# EAGLE design v2.1 Main (EAGLE 8.1.0)

## Sheet 1 of 3
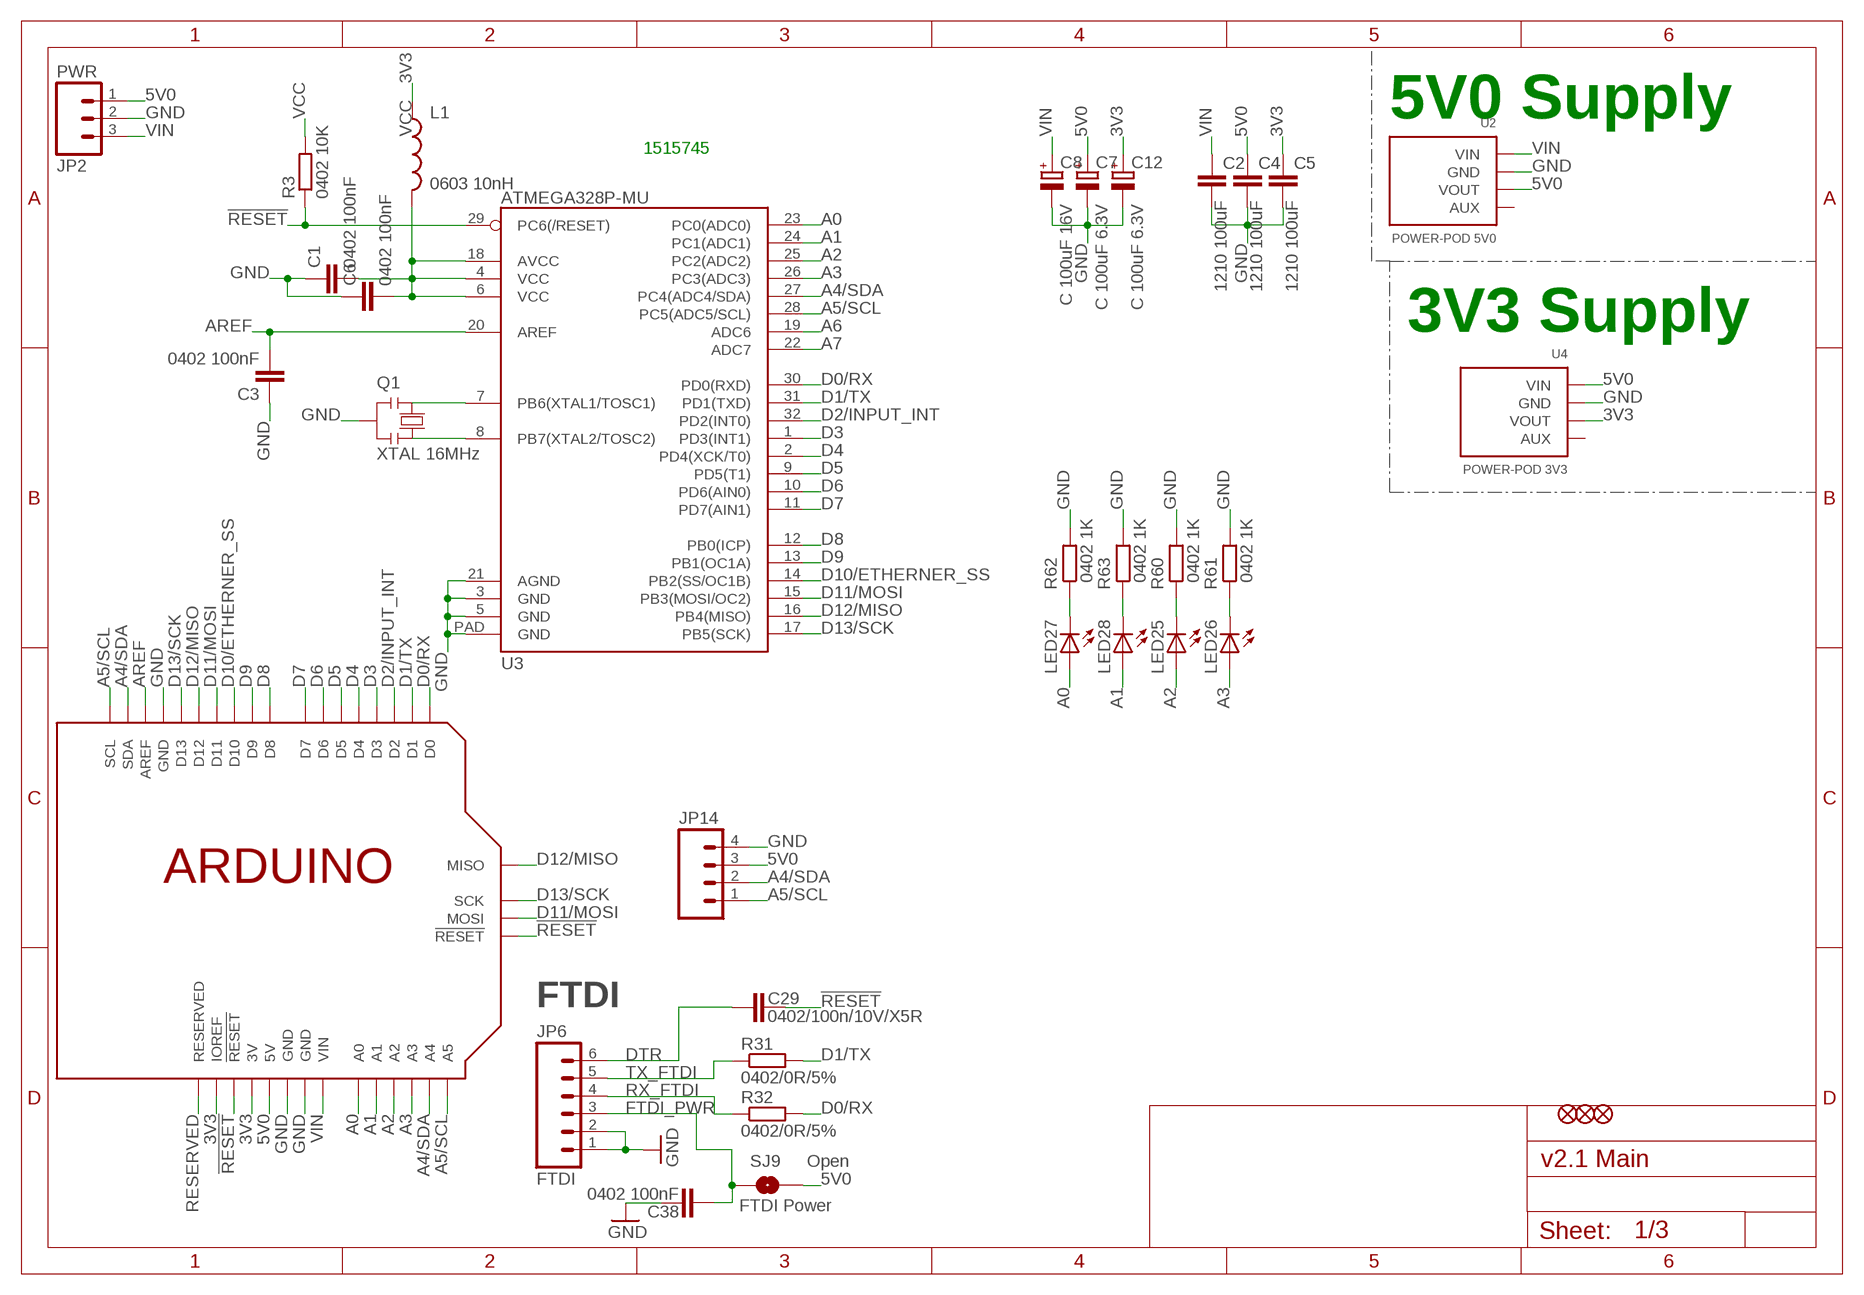
[diagram p0: schematic, sheet 1]

### Parts
C1  0402 100nF  C-EUC0402-SMALLER  [C0402-SMALLER]
C2  1210 100uF  C-EUC1210  [C1210]
C3  0402 100nF  C-EUC0402-SMALLER  [C0402-SMALLER]
C4  1210 100uF  C-EUC1210  [C1210]
C5  1210 100uF  C-EUC1210  [C1210]
C6  0402 100nF  C-EUC0402-SMALLER  [C0402-SMALLER]
C7  C 100uF 6.3V  CPOL-EUC  [PANASONIC_C]
C8  C 100uF 16V  CPOL-EUC  [PANASONIC_C]
C12  C 100uF 6.3V  CPOL-EUC  [PANASONIC_C]
C29  0402/100n/10V/X5R  C-EUC0402-ARDUINO-ROUND  [C0402-ARDUINO-ROUND]
C38  0402 100nF  C-EUC0402-SMALLER  [C0402-SMALLER]
JP2  PWR  M03-SCREW-5MM  [SCREWTERMINAL-5MM-3]
JP4  FIDUCIAL1X2.5-STOP  [FIDUCIAL-1X2.5-STOP]
JP6  FTDI  M06SIP  [1X06]
JP7  FIDUCIAL1X2.5-STOP  [FIDUCIAL-1X2.5-STOP]
JP9  FIDUCIAL1X2.5-STOP  [FIDUCIAL-1X2.5-STOP]
JP14  M04PTH  [1X04]
L1  0603 10nH  INDUCTOR0603K-SMALL  [C0603K-SMALL]
LED25  LED0805-1206  [LED-0805-1206]
LED26  LED0805-1206  [LED-0805-1206]
LED27  LED0805-1206  [LED-0805-1206]
LED28  LED0805-1206  [LED-0805-1206]
Q1  XTAL 16MHz  RESONATORMU  [RESONATOR]
R3  0402 10K  R-EU_R0402-SMALLER  [R0402-SMALLER]
R31  0402/0R/5%  R-EU_R0402-ARDUINO-ROUND  [R0402-ARDUINO-ROUND]
R32  0402/0R/5%  R-EU_R0402-ARDUINO-ROUND  [R0402-ARDUINO-ROUND]
R60  0402 1K  R-EU_R0402-SMALLER  [R0402-SMALLER]
R61  0402 1K  R-EU_R0402-SMALLER  [R0402-SMALLER]
R62  0402 1K  R-EU_R0402-SMALLER  [R0402-SMALLER]
R63  0402 1K  R-EU_R0402-SMALLER  [R0402-SMALLER]
SJ9  FTDI Power  SOLDERJUMPERTRACE  [SJ_2S-TRACE]
U1  ARDUINOSPI-REFRENCE  [ARDUINOR3-LWKTXT-REF-SPI]
U2  POWER-POD 5V0  POWER-POD  [POWER-POD-LANDING]
U3  ATMEGA328P-MU  ATMEGA328-MLF-SHORT  [MLF32-SHORT-CREAM]
U4  POWER-POD 3V3  POWER-POD  [POWER-POD-LANDING]

### Nets
3V3: C5.1 C12.+ L1.1 U1.3V U1.IOREF U4.3(VOUT)
5V0: C4.1 C7.+ JP2.1 JP14.3 SJ9.2 U1.5V U1.5V@ISP(5V) U2.3(VOUT) U4.1(VIN) ; also sheet 2,3
!RESET: C29.1 R3.1 U1.!RESET U1.!RESET@ISP(!RESET) U3.29(PC6(/RESET))
A0: LED27.A U1.A0 U3.23(PC0(ADC0))
A1: LED28.A U1.A1 U3.24(PC1(ADC1))
A2: LED25.A U1.A2 U3.25(PC2(ADC2))
A3: LED26.A U1.A3 U3.26(PC3(ADC3))
A4/SDA: JP14.2 U1.A4 U1.SDA U3.27(PC4(ADC4/SDA)) ; also sheet 2
A5/SCL: JP14.1 U1.A5 U1.SCL U3.28(PC5(ADC5/SCL)) ; also sheet 2
A6: U3.19(ADC6)
A7: U3.22(ADC7)
AREF: C3.2 U1.AREF U3.20(AREF)
D0/RX: R32.2 U1.D0 U3.30(PD0(RXD))
D1/TX: R31.2 U1.D1 U3.31(PD1(TXD))
D2/INPUT_INT: U1.D2 U3.32(PD2(INT0)) ; also sheet 2
D3: U1.D3 U3.1(PD3(INT1))
D4: U1.D4 U3.2(PD4(XCK/T0))
D5: U1.D5 U3.9(PD5(T1))
D6: U1.D6 U3.10(PD6(AIN0))
D7: U1.D7 U3.11(PD7(AIN1))
D8: U1.D8 U3.12(PB0(ICP))
D9: U1.D9 U3.13(PB1(OC1A))
D10/ETHERNER_SS: U1.D10 U3.14(PB2(SS/OC1B))
D11/MOSI: U1.D11 U1.MOSI U3.15(PB3(MOSI/OC2))
D12/MISO: U1.D12 U1.MISO U3.16(PB4(MISO))
D13/SCK: U1.D13 U1.SCK U3.17(PB5(SCK))
DTR: C29.2 JP6.6
FTDI_PWR: C38.2 JP6.3 SJ9.1
GND: C1.1 C2.2 C3.1 C4.2 C5.2 C6.1 C7.- C8.- C12.- C38.1 JP2.2 JP6.1 JP6.2 JP14.4 Q1.2 R60.2 R61.2 R62.2 R63.2 U1.GND@1(GND) U1.GND@2(GND) U1.GND@3(GND) U1.GND@ISP(GND) U2.2(GND) U3.3(GND) U3.5(GND) U3.21(AGND) U3.PAD(GND) U4.2(GND) ; also sheet 2
N$3: Q1.1 U3.7(PB6(XTAL1/TOSC1))
N$4: Q1.3 U3.8(PB7(XTAL2/TOSC2))
N$5: LED27.C R62.1
N$28: LED28.C R63.1
N$29: LED25.C R60.1
N$30: LED26.C R61.1
RESERVED: U1.RESERVED
RX_FTDI: JP6.4 R32.1
TX_FTDI: JP6.5 R31.1
VCC: C1.2 C6.2 L1.2 R3.2 U3.4(VCC) U3.6(VCC) U3.18(AVCC)
VIN: C2.1 C8.+ JP2.3 U1.VIN U2.1(VIN)
Unconnected: U2.4(AUX) U4.4(AUX)

### Notes on the sheet
- 5V0 Supply
- 1515745
- 3V3 Supply
- FTDI
- Open

## Sheet 2 of 3
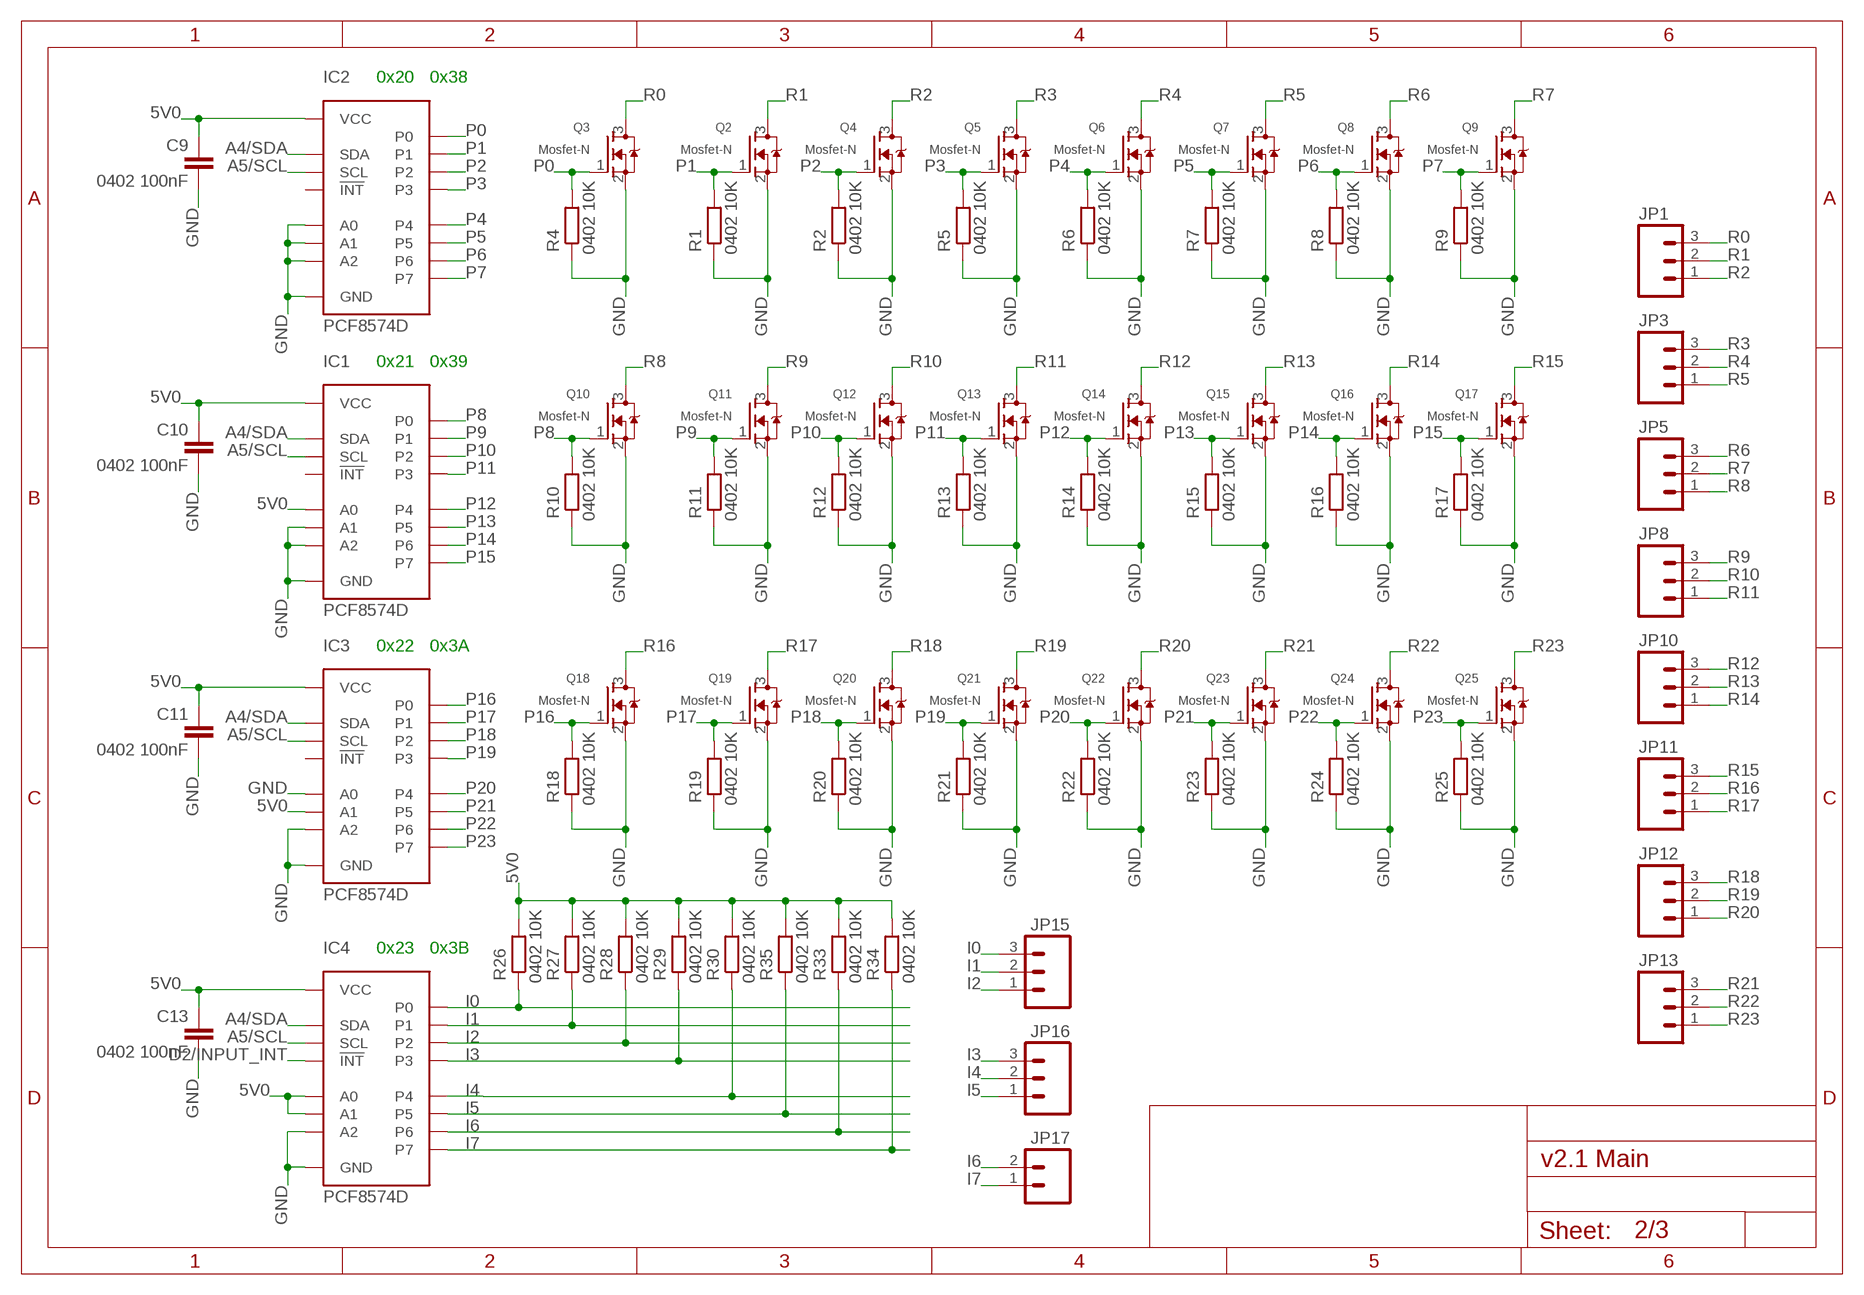
[diagram p1: schematic, sheet 2]

### Parts
C9  0402 100nF  C-EUC0402-SMALLER  [C0402-SMALLER]
C10  0402 100nF  C-EUC0402-SMALLER  [C0402-SMALLER]
C11  0402 100nF  C-EUC0402-SMALLER  [C0402-SMALLER]
C13  0402 100nF  C-EUC0402-SMALLER  [C0402-SMALLER]
IC1  PCF8574D  PCF8574SO16-7/5MM  [SO16-7.5MM]
IC2  PCF8574D  PCF8574SO16-7/5MM  [SO16-7.5MM]
IC3  PCF8574D  PCF8574SO16-7/5MM  [SO16-7.5MM]
IC4  PCF8574D  PCF8574SO16-7/5MM  [SO16-7.5MM]
JP1  M03-SCREW-5MM  [SCREWTERMINAL-5MM-3]
JP3  M03-SCREW-5MM  [SCREWTERMINAL-5MM-3]
JP5  M03-SCREW-5MM  [SCREWTERMINAL-5MM-3]
JP8  M03-SCREW-5MM  [SCREWTERMINAL-5MM-3]
JP10  M03-SCREW-5MM  [SCREWTERMINAL-5MM-3]
JP11  M03-SCREW-5MM  [SCREWTERMINAL-5MM-3]
JP12  M03-SCREW-5MM  [SCREWTERMINAL-5MM-3]
JP13  M03-SCREW-5MM  [SCREWTERMINAL-5MM-3]
JP15  M03-SCREW-5MM  [SCREWTERMINAL-5MM-3]
JP16  M03-SCREW-5MM  [SCREWTERMINAL-5MM-3]
JP17  M025MM  [SCREWTERMINAL-5MM-2]
Q2  Mosfet-N  MOSFET-N-SOT23-SPARK  [SOT23-3]
Q3  Mosfet-N  MOSFET-N-SOT23-SPARK  [SOT23-3]
Q4  Mosfet-N  MOSFET-N-SOT23-SPARK  [SOT23-3]
Q5  Mosfet-N  MOSFET-N-SOT23-SPARK  [SOT23-3]
Q6  Mosfet-N  MOSFET-N-SOT23-SPARK  [SOT23-3]
Q7  Mosfet-N  MOSFET-N-SOT23-SPARK  [SOT23-3]
Q8  Mosfet-N  MOSFET-N-SOT23-SPARK  [SOT23-3]
Q9  Mosfet-N  MOSFET-N-SOT23-SPARK  [SOT23-3]
Q10  Mosfet-N  MOSFET-N-SOT23-SPARK  [SOT23-3]
Q11  Mosfet-N  MOSFET-N-SOT23-SPARK  [SOT23-3]
Q12  Mosfet-N  MOSFET-N-SOT23-SPARK  [SOT23-3]
Q13  Mosfet-N  MOSFET-N-SOT23-SPARK  [SOT23-3]
Q14  Mosfet-N  MOSFET-N-SOT23-SPARK  [SOT23-3]
Q15  Mosfet-N  MOSFET-N-SOT23-SPARK  [SOT23-3]
Q16  Mosfet-N  MOSFET-N-SOT23-SPARK  [SOT23-3]
Q17  Mosfet-N  MOSFET-N-SOT23-SPARK  [SOT23-3]
Q18  Mosfet-N  MOSFET-N-SOT23-SPARK  [SOT23-3]
Q19  Mosfet-N  MOSFET-N-SOT23-SPARK  [SOT23-3]
Q20  Mosfet-N  MOSFET-N-SOT23-SPARK  [SOT23-3]
Q21  Mosfet-N  MOSFET-N-SOT23-SPARK  [SOT23-3]
Q22  Mosfet-N  MOSFET-N-SOT23-SPARK  [SOT23-3]
Q23  Mosfet-N  MOSFET-N-SOT23-SPARK  [SOT23-3]
Q24  Mosfet-N  MOSFET-N-SOT23-SPARK  [SOT23-3]
Q25  Mosfet-N  MOSFET-N-SOT23-SPARK  [SOT23-3]
R1  0402 10K  R-EU_R0402-SMALLER  [R0402-SMALLER]
R2  0402 10K  R-EU_R0402-SMALLER  [R0402-SMALLER]
R4  0402 10K  R-EU_R0402-SMALLER  [R0402-SMALLER]
R5  0402 10K  R-EU_R0402-SMALLER  [R0402-SMALLER]
R6  0402 10K  R-EU_R0402-SMALLER  [R0402-SMALLER]
R7  0402 10K  R-EU_R0402-SMALLER  [R0402-SMALLER]
R8  0402 10K  R-EU_R0402-SMALLER  [R0402-SMALLER]
R9  0402 10K  R-EU_R0402-SMALLER  [R0402-SMALLER]
R10  0402 10K  R-EU_R0402-SMALLER  [R0402-SMALLER]
R11  0402 10K  R-EU_R0402-SMALLER  [R0402-SMALLER]
R12  0402 10K  R-EU_R0402-SMALLER  [R0402-SMALLER]
R13  0402 10K  R-EU_R0402-SMALLER  [R0402-SMALLER]
R14  0402 10K  R-EU_R0402-SMALLER  [R0402-SMALLER]
R15  0402 10K  R-EU_R0402-SMALLER  [R0402-SMALLER]
R16  0402 10K  R-EU_R0402-SMALLER  [R0402-SMALLER]
R17  0402 10K  R-EU_R0402-SMALLER  [R0402-SMALLER]
R18  0402 10K  R-EU_R0402-SMALLER  [R0402-SMALLER]
R19  0402 10K  R-EU_R0402-SMALLER  [R0402-SMALLER]
R20  0402 10K  R-EU_R0402-SMALLER  [R0402-SMALLER]
R21  0402 10K  R-EU_R0402-SMALLER  [R0402-SMALLER]
R22  0402 10K  R-EU_R0402-SMALLER  [R0402-SMALLER]
R23  0402 10K  R-EU_R0402-SMALLER  [R0402-SMALLER]
R24  0402 10K  R-EU_R0402-SMALLER  [R0402-SMALLER]
R25  0402 10K  R-EU_R0402-SMALLER  [R0402-SMALLER]
R26  0402 10K  R-EU_R0402-SMALLER  [R0402-SMALLER]
R27  0402 10K  R-EU_R0402-SMALLER  [R0402-SMALLER]
R28  0402 10K  R-EU_R0402-SMALLER  [R0402-SMALLER]
R29  0402 10K  R-EU_R0402-SMALLER  [R0402-SMALLER]
R30  0402 10K  R-EU_R0402-SMALLER  [R0402-SMALLER]
R33  0402 10K  R-EU_R0402-SMALLER  [R0402-SMALLER]
R34  0402 10K  R-EU_R0402-SMALLER  [R0402-SMALLER]
R35  0402 10K  R-EU_R0402-SMALLER  [R0402-SMALLER]

### Nets
5V0: C9.1 C10.1 C11.1 C13.1 IC1.1(A0) IC1.16(VCC) IC2.16(VCC) IC3.2(A1) IC3.16(VCC) IC4.1(A0) IC4.2(A1) IC4.16(VCC) R26.2 R27.2 R28.2 R29.2 R30.2 R33.2 R34.2 R35.2 ; also sheet 1,3
A4/SDA: IC1.15(SDA) IC2.15(SDA) IC3.15(SDA) IC4.15(SDA) ; also sheet 1
A5/SCL: IC1.14(SCL) IC2.14(SCL) IC3.14(SCL) IC4.14(SCL) ; also sheet 1
D2/INPUT_INT: IC4.13(!INT) ; also sheet 1
GND: C9.2 C10.2 C11.2 C13.2 IC1.2(A1) IC1.3(A2) IC1.8(GND) IC2.1(A0) IC2.2(A1) IC2.3(A2) IC2.8(GND) IC3.1(A0) IC3.3(A2) IC3.8(GND) IC4.3(A2) IC4.8(GND) Q2.2(S) Q3.2(S) Q4.2(S) Q5.2(S) Q6.2(S) Q7.2(S) Q8.2(S) Q9.2(S) Q10.2(S) Q11.2(S) Q12.2(S) Q13.2(S) Q14.2(S) Q15.2(S) Q16.2(S) Q17.2(S) Q18.2(S) Q19.2(S) Q20.2(S) Q21.2(S) Q22.2(S) Q23.2(S) Q24.2(S) Q25.2(S) R1.1 R2.1 R4.1 R5.1 R6.1 R7.1 R8.1 R9.1 R10.1 R11.1 R12.1 R13.1 R14.1 R15.1 R16.1 R17.1 R18.1 R19.1 R20.1 R21.1 R22.1 R23.1 R24.1 R25.1 ; also sheet 1
I0: IC4.4(P0) JP15.3 R26.1
I1: IC4.5(P1) JP15.2 R27.1
I2: IC4.6(P2) JP15.1 R28.1
I3: IC4.7(P3) JP16.3 R29.1
I4: IC4.9(P4) JP16.2 R30.1
I5: IC4.10(P5) JP16.1 R35.1
I6: IC4.11(P6) JP17.2 R33.1
I7: IC4.12(P7) JP17.1 R34.1
P0: IC2.4(P0) Q3.1(G) R4.2 ; also sheet 3
P1: IC2.5(P1) Q2.1(G) R1.2 ; also sheet 3
P2: IC2.6(P2) Q4.1(G) R2.2 ; also sheet 3
P3: IC2.7(P3) Q5.1(G) R5.2 ; also sheet 3
P4: IC2.9(P4) Q6.1(G) R6.2 ; also sheet 3
P5: IC2.10(P5) Q7.1(G) R7.2 ; also sheet 3
P6: IC2.11(P6) Q8.1(G) R8.2 ; also sheet 3
P7: IC2.12(P7) Q9.1(G) R9.2 ; also sheet 3
P8: IC1.4(P0) Q10.1(G) R10.2 ; also sheet 3
P9: IC1.5(P1) Q11.1(G) R11.2 ; also sheet 3
P10: IC1.6(P2) Q12.1(G) R12.2 ; also sheet 3
P11: IC1.7(P3) Q13.1(G) R13.2 ; also sheet 3
P12: IC1.9(P4) Q14.1(G) R14.2 ; also sheet 3
P13: IC1.10(P5) Q15.1(G) R15.2 ; also sheet 3
P14: IC1.11(P6) Q16.1(G) R16.2 ; also sheet 3
P15: IC1.12(P7) Q17.1(G) R17.2 ; also sheet 3
P16: IC3.4(P0) Q18.1(G) R18.2 ; also sheet 3
P17: IC3.5(P1) Q19.1(G) R19.2 ; also sheet 3
P18: IC3.6(P2) Q20.1(G) R20.2 ; also sheet 3
P19: IC3.7(P3) Q21.1(G) R21.2 ; also sheet 3
P20: IC3.9(P4) Q22.1(G) R22.2 ; also sheet 3
P21: IC3.10(P5) Q23.1(G) R23.2 ; also sheet 3
P22: IC3.11(P6) Q24.1(G) R24.2 ; also sheet 3
P23: IC3.12(P7) Q25.1(G) R25.2 ; also sheet 3
R0: JP1.3 Q3.3(D)
R1: JP1.2 Q2.3(D)
R2: JP1.1 Q4.3(D)
R3: JP3.3 Q5.3(D)
R4: JP3.2 Q6.3(D)
R5: JP3.1 Q7.3(D)
R6: JP5.3 Q8.3(D)
R7: JP5.2 Q9.3(D)
R8: JP5.1 Q10.3(D)
R9: JP8.3 Q11.3(D)
R10: JP8.2 Q12.3(D)
R11: JP8.1 Q13.3(D)
R12: JP10.3 Q14.3(D)
R13: JP10.2 Q15.3(D)
R14: JP10.1 Q16.3(D)
R15: JP11.3 Q17.3(D)
R16: JP11.2 Q18.3(D)
R17: JP11.1 Q19.3(D)
R18: JP12.3 Q20.3(D)
R19: JP12.2 Q21.3(D)
R20: JP12.1 Q22.3(D)
R21: JP13.3 Q23.3(D)
R22: JP13.2 Q24.3(D)
R23: JP13.1 Q25.3(D)
Unconnected: IC1.13(!INT) IC2.13(!INT) IC3.13(!INT)

### Notes on the sheet
- 0x20 | 0x38
- 0x21 | 0x39
- 0x22 | 0x3A
- 0x23 | 0x3B

## Sheet 3 of 3
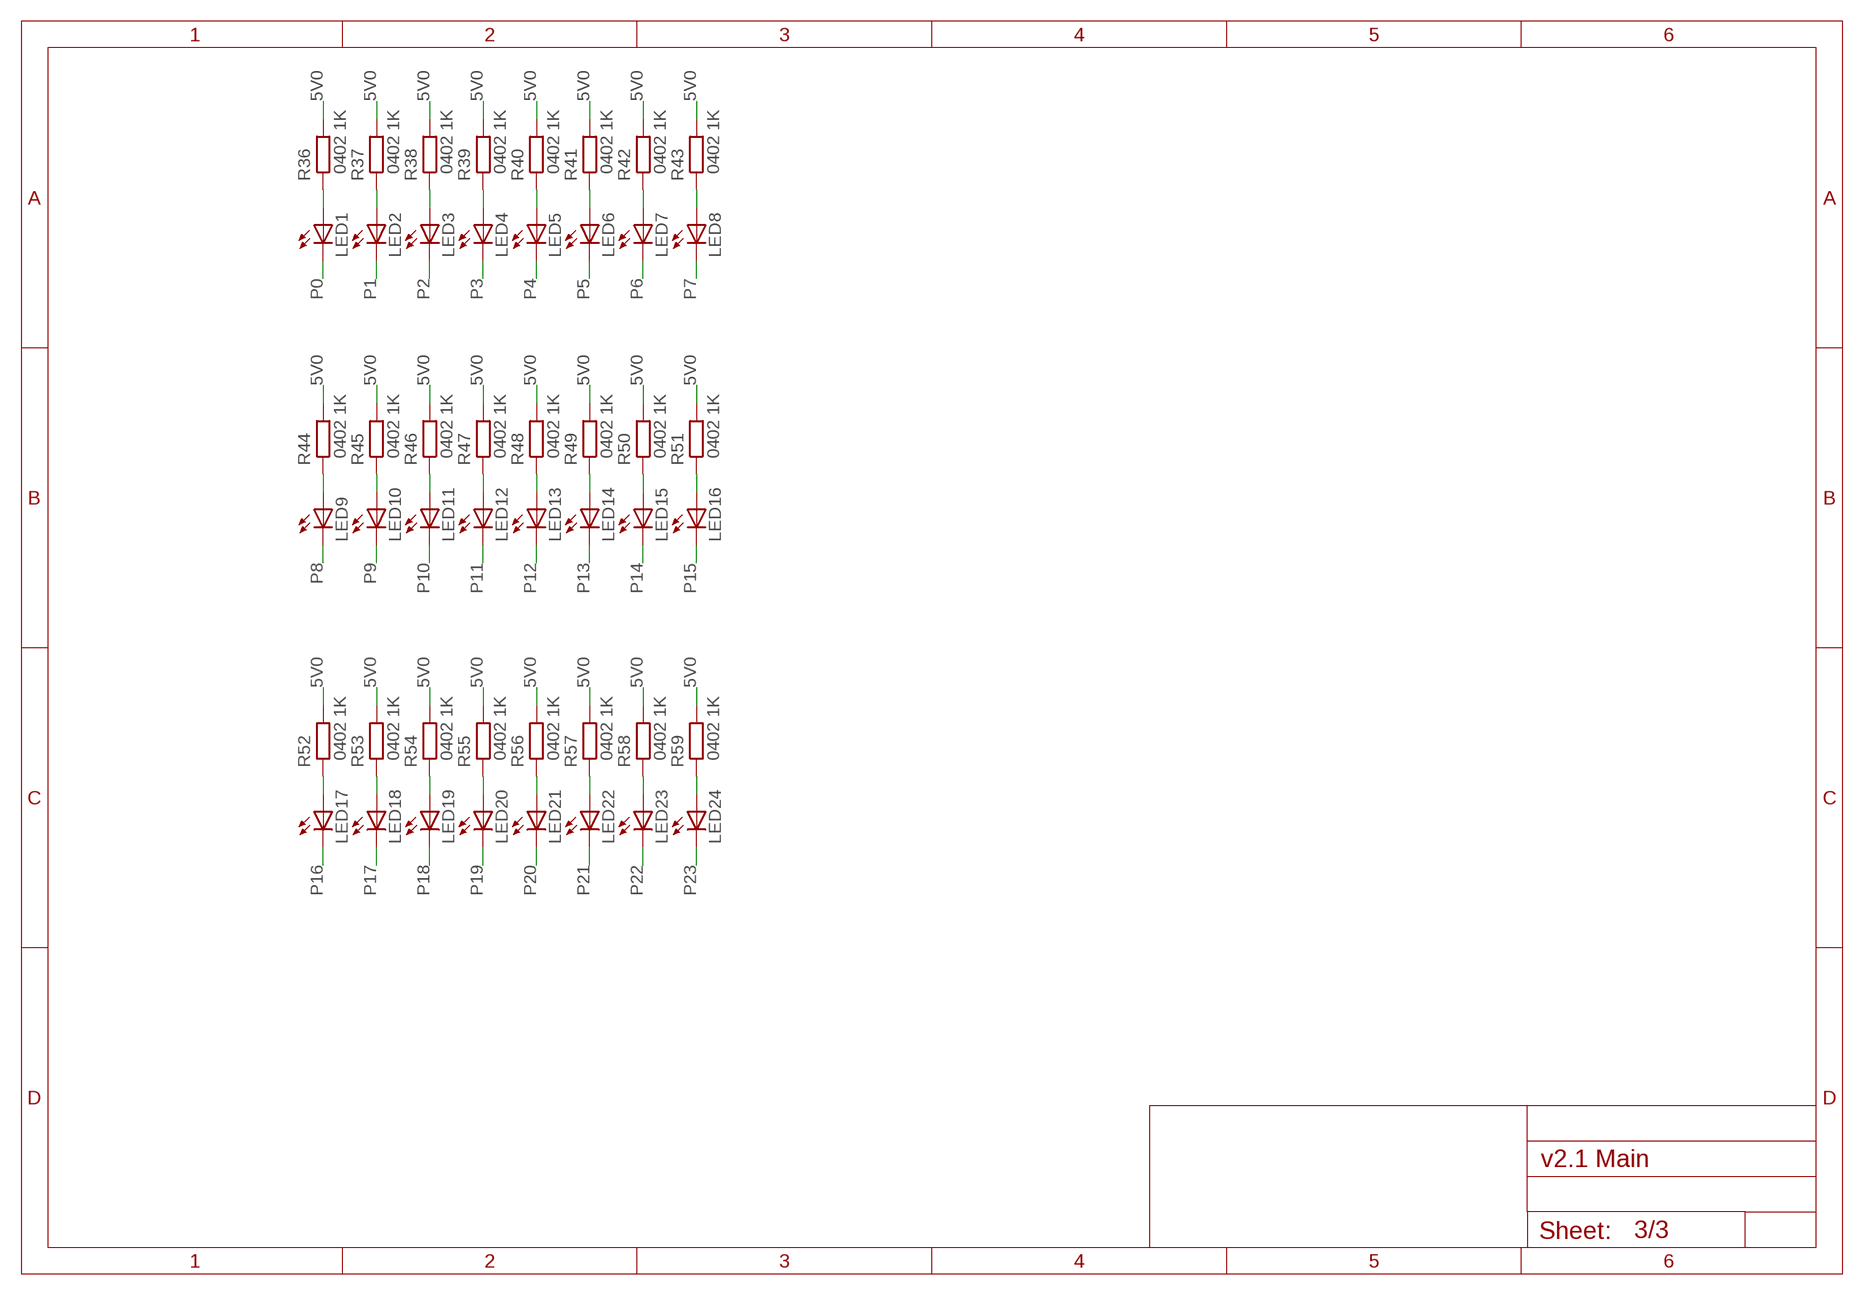
[diagram p2: schematic, sheet 3]

### Parts
LED1  LED0805-1206  [LED-0805-1206]
LED2  LED0805-1206  [LED-0805-1206]
LED3  LED0805-1206  [LED-0805-1206]
LED4  LED0805-1206  [LED-0805-1206]
LED5  LED0805-1206  [LED-0805-1206]
LED6  LED0805-1206  [LED-0805-1206]
LED7  LED0805-1206  [LED-0805-1206]
LED8  LED0805-1206  [LED-0805-1206]
LED9  LED0805-1206  [LED-0805-1206]
LED10  LED0805-1206  [LED-0805-1206]
LED11  LED0805-1206  [LED-0805-1206]
LED12  LED0805-1206  [LED-0805-1206]
LED13  LED0805-1206  [LED-0805-1206]
LED14  LED0805-1206  [LED-0805-1206]
LED15  LED0805-1206  [LED-0805-1206]
LED16  LED0805-1206  [LED-0805-1206]
LED17  LED0805-1206  [LED-0805-1206]
LED18  LED0805-1206  [LED-0805-1206]
LED19  LED0805-1206  [LED-0805-1206]
LED20  LED0805-1206  [LED-0805-1206]
LED21  LED0805-1206  [LED-0805-1206]
LED22  LED0805-1206  [LED-0805-1206]
LED23  LED0805-1206  [LED-0805-1206]
LED24  LED0805-1206  [LED-0805-1206]
R36  0402 1K  R-EU_R0402-SMALLER  [R0402-SMALLER]
R37  0402 1K  R-EU_R0402-SMALLER  [R0402-SMALLER]
R38  0402 1K  R-EU_R0402-SMALLER  [R0402-SMALLER]
R39  0402 1K  R-EU_R0402-SMALLER  [R0402-SMALLER]
R40  0402 1K  R-EU_R0402-SMALLER  [R0402-SMALLER]
R41  0402 1K  R-EU_R0402-SMALLER  [R0402-SMALLER]
R42  0402 1K  R-EU_R0402-SMALLER  [R0402-SMALLER]
R43  0402 1K  R-EU_R0402-SMALLER  [R0402-SMALLER]
R44  0402 1K  R-EU_R0402-SMALLER  [R0402-SMALLER]
R45  0402 1K  R-EU_R0402-SMALLER  [R0402-SMALLER]
R46  0402 1K  R-EU_R0402-SMALLER  [R0402-SMALLER]
R47  0402 1K  R-EU_R0402-SMALLER  [R0402-SMALLER]
R48  0402 1K  R-EU_R0402-SMALLER  [R0402-SMALLER]
R49  0402 1K  R-EU_R0402-SMALLER  [R0402-SMALLER]
R50  0402 1K  R-EU_R0402-SMALLER  [R0402-SMALLER]
R51  0402 1K  R-EU_R0402-SMALLER  [R0402-SMALLER]
R52  0402 1K  R-EU_R0402-SMALLER  [R0402-SMALLER]
R53  0402 1K  R-EU_R0402-SMALLER  [R0402-SMALLER]
R54  0402 1K  R-EU_R0402-SMALLER  [R0402-SMALLER]
R55  0402 1K  R-EU_R0402-SMALLER  [R0402-SMALLER]
R56  0402 1K  R-EU_R0402-SMALLER  [R0402-SMALLER]
R57  0402 1K  R-EU_R0402-SMALLER  [R0402-SMALLER]
R58  0402 1K  R-EU_R0402-SMALLER  [R0402-SMALLER]
R59  0402 1K  R-EU_R0402-SMALLER  [R0402-SMALLER]

### Nets
5V0: R36.2 R37.2 R38.2 R39.2 R40.2 R41.2 R42.2 R43.2 R44.2 R45.2 R46.2 R47.2 R48.2 R49.2 R50.2 R51.2 R52.2 R53.2 R54.2 R55.2 R56.2 R57.2 R58.2 R59.2 ; also sheet 1,2
N$1: LED1.A R36.1
N$2: LED2.A R37.1
N$6: LED3.A R38.1
N$7: LED4.A R39.1
N$8: LED5.A R40.1
N$9: LED6.A R41.1
N$10: LED7.A R42.1
N$11: LED8.A R43.1
N$12: LED9.A R44.1
N$13: LED10.A R45.1
N$14: LED11.A R46.1
N$15: LED12.A R47.1
N$16: LED13.A R48.1
N$17: LED14.A R49.1
N$18: LED15.A R50.1
N$19: LED16.A R51.1
N$20: LED17.A R52.1
N$21: LED18.A R53.1
N$22: LED19.A R54.1
N$23: LED20.A R55.1
N$24: LED21.A R56.1
N$25: LED22.A R57.1
N$26: LED23.A R58.1
N$27: LED24.A R59.1
P0: LED1.C ; also sheet 2
P1: LED2.C ; also sheet 2
P2: LED3.C ; also sheet 2
P3: LED4.C ; also sheet 2
P4: LED5.C ; also sheet 2
P5: LED6.C ; also sheet 2
P6: LED7.C ; also sheet 2
P7: LED8.C ; also sheet 2
P8: LED9.C ; also sheet 2
P9: LED10.C ; also sheet 2
P10: LED11.C ; also sheet 2
P11: LED12.C ; also sheet 2
P12: LED13.C ; also sheet 2
P13: LED14.C ; also sheet 2
P14: LED15.C ; also sheet 2
P15: LED16.C ; also sheet 2
P16: LED17.C ; also sheet 2
P17: LED18.C ; also sheet 2
P18: LED19.C ; also sheet 2
P19: LED20.C ; also sheet 2
P20: LED21.C ; also sheet 2
P21: LED22.C ; also sheet 2
P22: LED23.C ; also sheet 2
P23: LED24.C ; also sheet 2

## Library data of the parts
C1-C6 C9-C11 C13 = CISECO eaglecad designs:C-EU: CAPACITOR, European symbol
C7 C8 C12 = rcl:CPOL-EU: POLARIZED CAPACITOR, European symbol
C29 C38 = TiLDA Mk2 Parts:C-EU: CAPACITOR, European symbol
IC1-IC4 = CISECO eaglecad designs:PCF8574
JP1-JP3 JP5 JP8 JP10-JP13 JP15 JP16 = CISECO eaglecad designs:M03: Header 3 Standard 3-pin 0.1" header. Use with straight break away headers (SKU : PRT-00116), right angle break away headers (PRT-00553), swiss pins (PRT-00743), machine pins (PRT-00117), and female headers (PRT-00115). Molex polarized connector foot print use with SKU : PRT-08232 with associated crimp pins and housings.
JP4 JP7 JP9 = CISECO eaglecad designs:FIDUCIAL: Fiducial Alignment Points Various fiducial points for machine vision alignment.
JP6 = TiLDA Mk2 Parts:M06: Header 6 Standard 6-pin 0.1" header. Use with straight break away headers (SKU : PRT-00116), right angle break away headers (PRT-00553), swiss pins (PRT-00743), machine pins (PRT-00117), and female headers (PRT-00115). Molex polarized connector foot print use with SKU : PRT-08094 with associated crimp pins and housings. NOTES ON THE VARIANTS LOCK and LOCK_LONGPADS... This footprint was designed to help hold the alignment of a through-hole component (i.e. 6-pin header) while soldering it into place. You may notice that each hole has been shifted either up or down by 0.005 of an inch from it's more standard position (which is a perfectly straight line). This slight alteration caused the pins (the squares in the middle) to touch the edges of the holes. Because they are alternating, it causes a "brace" to hold the component in place. 0.005 has proven to be the perfect amount of "off-center" position when using our standard breakaway headers. Although looks a little odd when you look at the bare footprint, once you have a header in there, the alteration is very hard to notice. Also, if you push a header all the way into place, it is covered up entirely on the bottom side. This idea of altering the position of holes to aid alignment will be further integrated into the Sparkfun Library for other footprints. It can help hold any component with 3 or more connection pins.
JP14 = SparkFunJan12:M04: Header 4 Standard 4-pin 0.1" header. Use with straight break away headers (SKU : PRT-00116), right angle break away headers (PRT-00553), swiss pins (PRT-00743), machine pins (PRT-00117), and female headers (PRT-00115). Molex polarized connector foot print use with SKU : PRT-08231 with associated crimp pins and housings. 1MM SMD Version SKU: PRT-10208
JP17 = CISECO eaglecad designs:M02: Header 2 Standard 2-pin 0.1" header. Use with straight break away headers (SKU : PRT-00116), right angle break away headers (PRT-00553), swiss pins (PRT-00743), machine pins (PRT-00117), and female headers (PRT-00115). Molex polarized connector foot print use with SKU : PRT-08233 with associated crimp pins and housings.
L1 = CISECO eaglecad designs:INDUCTOR: Inductors Basic Inductor/Choke - 0603 and 1206. Footprints are not proven and vary greatly between part numbers.
LED1-LED28 = CISECO eaglecad designs:LED: LEDs Standard schematic elements and footprints for 5mm, 3mm, 1206, and 0603 sized LEDs. 5mm - Spark Fun Electronics SKU : COM-00529 (and others)
Q1 = MySMD2:RESONATOR
Q2-Q25 = TiLDA Mk2 Parts:MOSFET-N: N-Channel Mosfet 2N7002E - 60V 260mA SOT23 [Digikey: 2N7002ET1GOSTR-ND] - REEL BSH103 - 30V 850mA SOT23 [Digikey: 568-5013-1-ND]
R1-R30 R33-R63 = CISECO eaglecad designs:R-EU_: RESISTOR, European symbol
R31 R32 = TiLDA Mk2 Parts:R-EU_: RESISTOR, European symbol
SJ9 = TiLDA Mk2 Parts:SOLDERJUMPER: Solder Jumper Standard SMD solder jumper. Used to automate production. Two varients : Normally Open and Normally Closed are the same, but have different paste layers. NC will have a large amount of paste and should jumper during reflow.
U1 = CISECO eaglecad designs:ARDUINOSPI
U2 U4 = Ciseco Footprints:POWER-POD
U3 = CISECO eaglecad designs:ATMEGA328-MLF

## Net classes
2 MAINS: clearance 4 mm

## Board
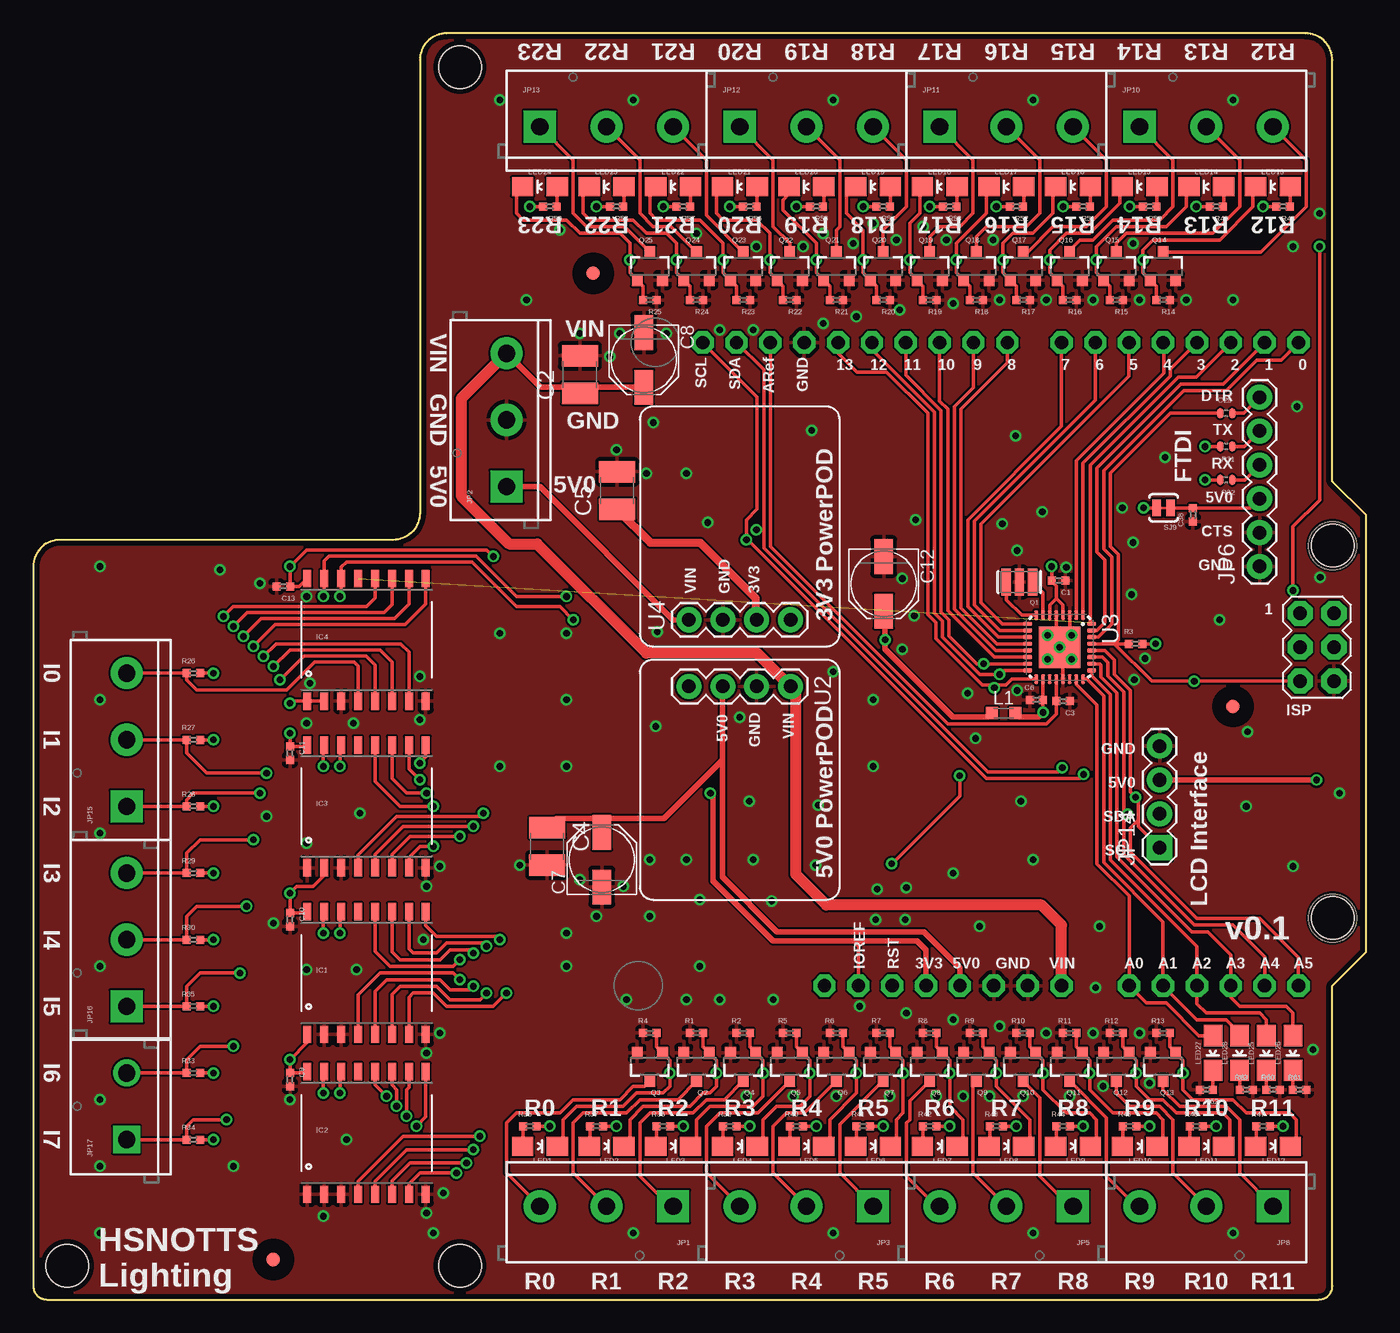
[diagram p3: board, top side]
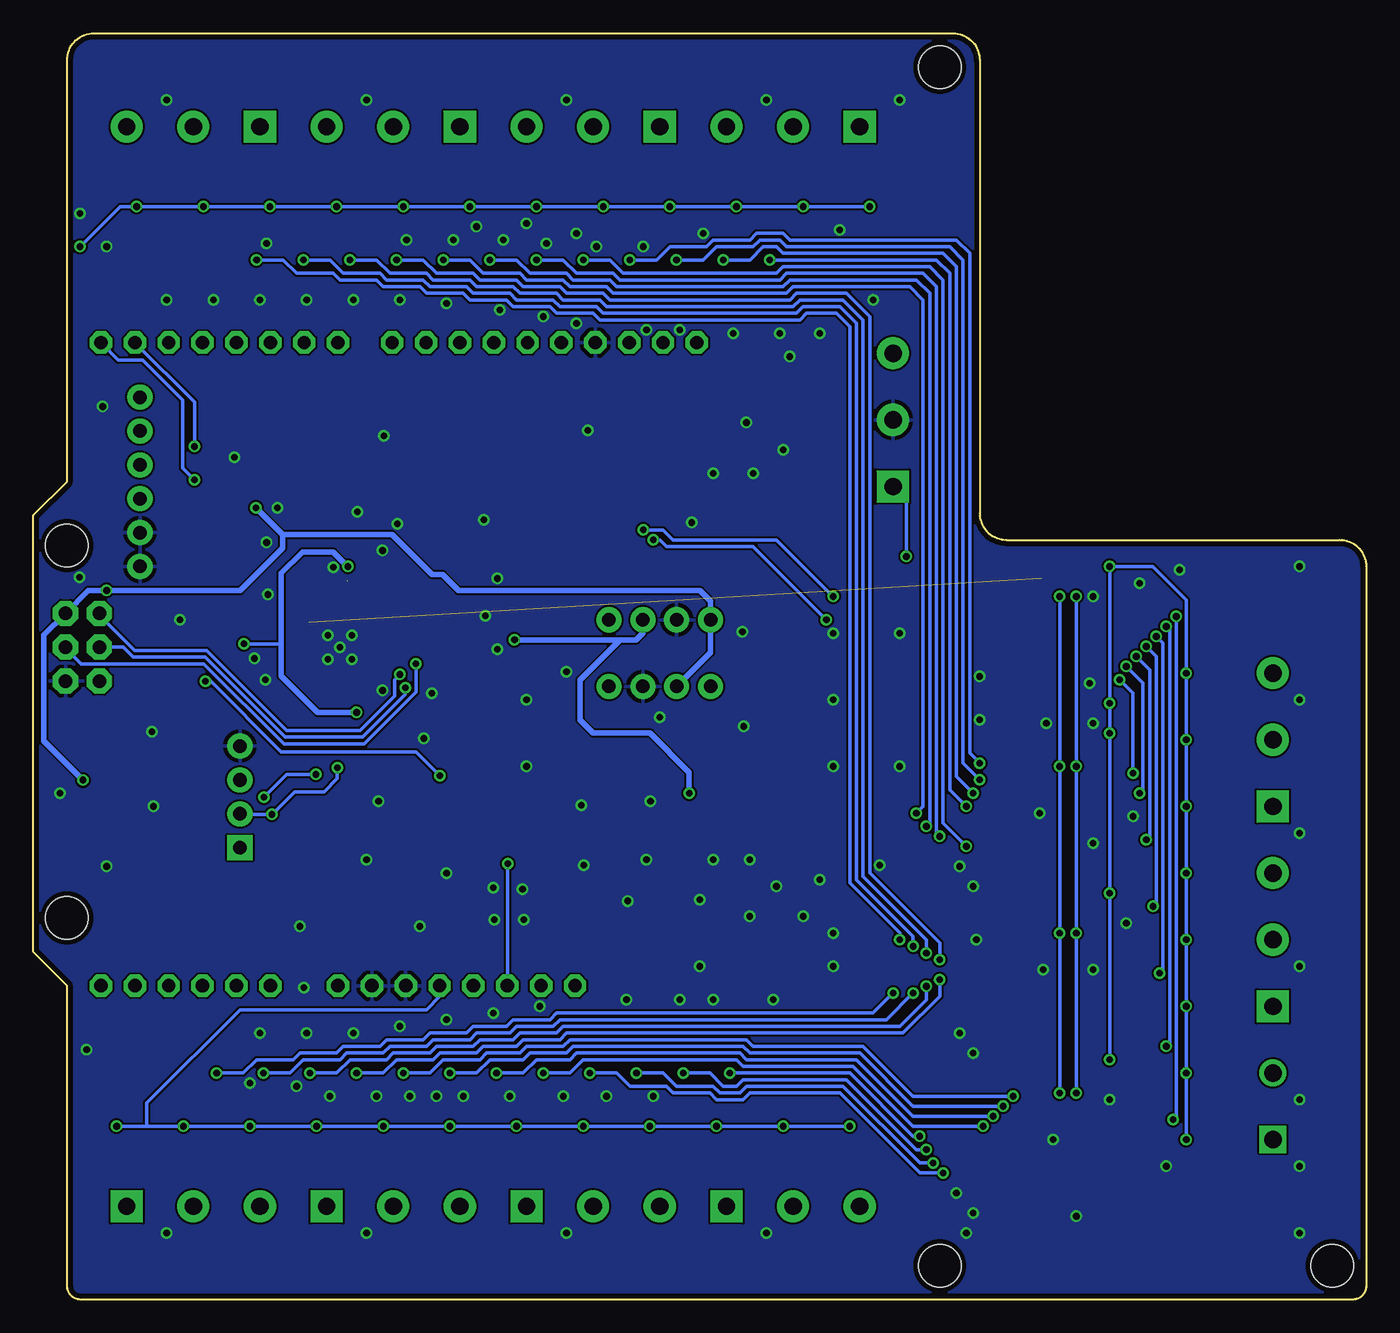
[diagram p4: board, bottom side, seen from below]

Size 100 x 95 mm. Coordinates in mm from the lower left corner, seen from the top.
Outline: 97.46,61.39 97.46,93 arc90 95.46,95 31,95 arc90 29,93 29,59 arc-90 27,57 2,57 arc90 0,55 0,1 arc90 1,0 96.46,0 arc90 97.46,1 97.46,23.54 100,26.08 100,58.85 97.46,61.39
Copper layers (1*16): Top 0.0356mm / dielectric 1.5011mm / Bottom 0.0356mm
Design rules "default *": minimum track width 6mil, minimum drill 13mil, track to track 6mil, track to pad 6mil, pad to pad 6mil, via to via 6mil, smd to smd 6mil, copper to edge 15mil, drill to drill 6mil, minimum pad ring 7mil, minimum via ring 7mil, stop-mask expansion 3mil, vias tented up to drill 23mil, thermal gap 12mil
Holes 3.2 mm at 32,2.54 97.48,56.56 97.48,28.62 32,92.46 2.54,2.54

### Footprints (pad centres in the part's own frame; a part is rotated, then mirrored left to right if it is on the bottom)
C0402-SMALLER = smd 0.6 x 0.6: 1 -0.5,0; 2 0.5,0
C1210 = smd 1.6 x 2.7: 1 -1.4,0; 2 1.4,0
PANASONIC_C = smd 2.6 x 1.4: + 2.05,0; - -2.05,0
C0402-ARDUINO-ROUND = smd 0.508 x 0.762: 1 -0.445,0; 2 0.445,0
SO16-7.5MM = smd 0.6 x 1.3: 1 -4.445,-4.6; 2 -3.175,-4.6; 3 -1.905,-4.6; 4 -0.635,-4.6; 5 0.635,-4.6; 6 1.905,-4.6; 7 3.175,-4.6; 8 4.445,-4.6; 9 4.445,4.6; 10 3.175,4.6; 11 1.905,4.6; 12 0.635,4.6; 13 -0.635,4.6; 14 -1.905,4.6; 15 -3.175,4.6; 16 -4.445,4.6
SCREWTERMINAL-5MM-3 = drill 1.3 pad 2.413 square: 1 0,0 | drill 1.3 pad 2.413: 2 5,0; 3 10,0
FIDUCIAL-1X2.5-STOP = smd 1 x 1: 1 0,0
1X06 = drill 1.016 pad 1.88: 1 0,0; 2 2.54,0; 3 5.08,0; 4 7.62,0; 5 10.16,0; 6 12.7,0
1X04 = drill 1.016 pad 1.88 square: 1 0,0 | drill 1.016 pad 1.88: 2 2.54,0; 3 5.08,0; 4 7.62,0
SCREWTERMINAL-5MM-2 = drill 1.3 pad 2.032 square: 1 0,0 | drill 1.3 pad 2.032: 2 5,0
C0603K-SMALL = smd 0.889 x 0.889: 1 -0.875,0; 2 0.875,0
LED-0805-1206 = smd 1.6 x 1.4: A 1.3,0; C -1.3,0
RESONATOR = smd 0.7 x 2: 1 -1,0; 2 0,0; 3 1,0
SOT23-3 = smd 0.8 x 0.9: 1 -0.95,-1; 2 0.95,-1; 3 0,1.1
R0402-SMALLER = smd 0.6 x 0.6: 1 -0.5,0; 2 0.5,0
R0402-ARDUINO-ROUND = smd 0.508 x 0.762: 1 -0.445,0; 2 0.445,0
SJ_2S-TRACE = smd 0.635 x 1.27: 1 -0.508,0; 2 0.508,0
ARDUINOR3-LWKTXT-REF-SPI = drill 1 pad 1.676 octagon: 3V 35.56,2.54; 5V 38.1,2.54; !RESET 33.02,2.54; A0 50.8,2.54; A1 53.34,2.54; A2 55.88,2.54; A3 58.42,2.54; A4 60.96,2.54; A5 63.5,2.54; AREF 23.876,50.8; D0 63.5,50.8; D1 60.96,50.8; D2 58.42,50.8; D3 55.88,50.8; D4 53.34,50.8; D5 50.8,50.8; D6 48.26,50.8; D7 45.72,50.8; D8 41.656,50.8; D9 39.116,50.8; D10 36.576,50.8; D11 34.036,50.8; D12 31.496,50.8; D13 28.956,50.8; GND@1 43.18,2.54; GND@2 40.64,2.54; GND@3 26.416,50.8; IOREF 30.48,2.54; RESERVED 27.94,2.54; SCL 18.796,50.8; SDA 21.336,50.8; VIN 45.72,2.54 | drill 1.016 pad 1.88 octagon: 5V@ISP 66.167,30.48; !RESET@ISP 63.627,25.4; GND@ISP 66.167,25.4; MISO 63.627,30.48; MOSI 66.167,27.94; SCK 63.627,27.94
POWER-POD-LANDING = drill 1.016 pad 1.88: 1 -3.81,0; 2 -1.27,0; 3 1.27,0; 4 3.81,0
MLF32-SHORT-CREAM = smd 0.7 x 0.28: 1 -2.4,1.75; 2 -2.4,1.25; 3 -2.4,0.75; 4 -2.4,0.25; 5 -2.4,-0.25; 6 -2.4,-0.75; 7 -2.4,-1.25; 8 -2.4,-1.75; 17 2.4,-1.75; 18 2.4,-1.25; 19 2.4,-0.75; 20 2.4,-0.25; 21 2.4,0.25; 22 2.4,0.75; 23 2.4,1.25; 24 2.4,1.75 | smd 0.28 x 0.7: 9 -1.75,-2.4; 10 -1.25,-2.4; 11 -0.75,-2.4; 12 -0.25,-2.4; 13 0.25,-2.4; 14 0.75,-2.4; 15 1.25,-2.4; 16 1.75,-2.4; 25 1.75,2.4; 26 1.25,2.4; 27 0.75,2.4; 28 0.25,2.4; 29 -0.25,2.4; 30 -0.75,2.4; 31 -1.25,2.4; 32 -1.75,2.4 | smd 3.1 x 3.1: PAD 0,0

### Placement (x,y rotation side)
C1  76.93,53.94 180 top
C2  41,69.4 90 top
C3  77.25,44.9 180 top
C4  38.55,34 270 top
C5  43.8,60.7 90 top
C6  75.25,45 0 top
C7  42.65,33 90 top
C8  45.8,70.5 270 top
C9  19.25,16.5 270 top
C10  19.25,28.5 270 top
C11  19.25,41 270 top
C12  63.8,53.7 270 top
C13  18.75,53.5 180 top
C29  89.5,66.5 0 top
C38  87,58.88 90 top
IC1  25,24.5 0 top
IC2  25,12.5 0 top
IC3  25,37 0 top
IC4  25,49.5 0 top
JP1  48,7 180 top
JP2  35.5,61 90 top
JP3  63,7 180 top
JP4  18,3 0 top
JP5  78,7 180 top
JP6  92,55 90 top
JP7  42,77 0 top
JP8  93,7 180 top
JP9  90,44.5 0 top
JP10  83,88 0 top
JP11  68,88 0 top
JP12  53,88 0 top
JP13  38,88 0 top
JP14  84.5,33.9 90 top
JP15  7,37 90 top
JP16  7,22 90 top
JP17  7,12 90 top
L1  72.8,44 0 top
LED1  38,11.5 180 top
LED2  43,11.5 180 top
LED3  48,11.5 180 top
LED4  53,11.5 180 top
LED5  58,11.5 180 top
LED6  63,11.5 180 top
LED7  68,11.5 180 top
LED8  73,11.5 180 top
LED9  78,11.5 180 top
LED10  83,11.5 180 top
LED11  88,11.5 180 top
LED12  93,11.5 180 top
LED13  93,83.5 0 top
LED14  88,83.5 0 top
LED15  83,83.5 0 top
LED16  78,83.5 0 top
LED17  73,83.5 0 top
LED18  68,83.5 0 top
LED19  63,83.5 0 top
LED20  58,83.5 0 top
LED21  53,83.5 0 top
LED22  48,83.5 0 top
LED23  43,83.5 0 top
LED24  38,83.5 0 top
LED25  92.5,18.5 90 top
LED26  94.5,18.5 90 top
LED27  88.5,18.5 90 top
LED28  90.5,18.5 90 top
Q1  73.98,53.83 180 top
Q2  49.75,17.5 180 top
Q3  46.25,17.5 180 top
Q4  53.25,17.5 180 top
Q5  56.75,17.5 180 top
Q6  60.25,17.5 180 top
Q7  63.75,17.5 180 top
Q8  67.25,17.5 180 top
Q9  70.75,17.5 180 top
Q10  74.25,17.5 180 top
Q11  77.75,17.5 180 top
Q12  81.25,17.5 180 top
Q13  84.75,17.5 180 top
Q14  84.75,77.5 0 top
Q15  81.25,77.5 0 top
Q16  77.75,77.5 0 top
Q17  74.25,77.5 0 top
Q18  70.75,77.5 0 top
Q19  67.25,77.5 0 top
Q20  63.75,77.5 0 top
Q21  60.25,77.5 0 top
Q22  56.75,77.5 0 top
Q23  53.25,77.5 0 top
Q24  49.75,77.5 0 top
Q25  46.25,77.5 0 top
R1  49.75,20 0 top
R2  53.25,20 0 top
R3  82.7,49.2 0 top
R4  46.25,20 0 top
R5  56.75,20 0 top
R6  60.25,20 0 top
R7  63.75,20 0 top
R8  67.25,20 0 top
R9  70.75,20 0 top
R10  74.25,20 0 top
R11  77.75,20 0 top
R12  81.25,20 0 top
R13  84.75,20 0 top
R14  84.75,75 180 top
R15  81.25,75 180 top
R16  77.75,75 180 top
R17  74.25,75 180 top
R18  70.75,75 180 top
R19  67.25,75 180 top
R20  63.75,75 180 top
R21  60.25,75 180 top
R22  56.75,75 180 top
R23  53.25,75 180 top
R24  49.75,75 180 top
R25  46.25,75 180 top
R26  12,47 0 top
R27  12,42 0 top
R28  12,37 0 top
R29  12,32 0 top
R30  12,27 0 top
R31  89.5,64 180 top
R32  89.5,61.5 180 top
R33  12,17 0 top
R34  12,12 0 top
R35  12,22 0 top
R36  37.25,13 0 top
R37  42.25,13 0 top
R38  47.25,13 0 top
R39  52.25,13 0 top
R40  57.25,13 0 top
R41  62.25,13 0 top
R42  67.25,13 0 top
R43  72.25,13 0 top
R44  77.25,13 0 top
R45  82.25,13 0 top
R46  87.25,13 0 top
R47  92.25,13 0 top
R48  93.75,82 180 top
R49  88.75,82 180 top
R50  83.75,82 180 top
R51  78.75,82 180 top
R52  73.75,82 180 top
R53  68.75,82 180 top
R54  63.75,82 180 top
R55  58.75,82 180 top
R56  53.75,82 180 top
R57  48.75,82 180 top
R58  43.75,82 180 top
R59  38.75,82 180 top
R60  93,15.75 0 top
R61  95,15.75 0 top
R62  88,15.75 180 top
R63  91,15.75 0 top
SJ9  84.8,59.4 180 top
U1  31.42,21 0 top
U2  53,46 180 top
U3  77,48.95 270 top
U4  53,51 0 top

### Tracks (layer width: path | path; a pad name or v marks a point on that pad's centre or on a via)
3V3  (via drill 0.5)
  Top 0.25: U1.IOREF 61.9,26.5 61.5,26.9
  Top 0.406: U1.3V 66.98,26.22 66.3,26.9 61.5,26.9 55.5,26.9 51,31.4 51,37.8 v50.8,38 | C12.+ 63.9,51.65 v63.9,49.5 63.9,48.8 69,43.7 71.62,43.7 L1.1
  Top 0.61: U4.3 54.2,51.07 54.2,52.6 50.02,56.78 46.3,56.78 43.8,59.28 C5.1
  Bottom 0.406: v50.8,38 50.8,39.55 53.75,42.5 58,42.5 59,43.5 59,46.5 56,49.5 | U4.3 54.27,50 54.77,49.5 56,49.5 | 56,49.5 v63.9,49.5
5V0  (via drill 0.5)
  Top 0.25: v83.3,59.4 SJ9.2 | R26.2 v13.5,47 | R34.2 v13.5,12 | R33.2 v13.5,17 | v13.5,22 R35.2 | R29.2 v13.5,32 | R28.2 v13.5,37 | R27.2 v13.5,42 | R30.2 v13.5,27 | v34.5,55.75 34,56.25 20.5,56.25 v19.25,55 C13.1 19.95,53.5 IC4.16 | v19.25,42.5 C11.1 20.45,41.5 IC3.16 | v19.25,30.5 C10.1 20.45,29 IC1.16 | v19.25,30.5 19.25,30.75 | IC4.2 IC4.1 19.4,44.9 v19.25,44.75 | IC2.16 20.45,17 C9.1 v19.25,18 20.55,19.3 IC1.1 | IC3.2 21.82,31.82 21,31 19.75,31 v19.25,30.5 | R49.2 v87.25,82 | R50.2 v82.25,82 | R51.2 v77.25,82 | v72.25,82 R52.2 | R53.2 v67.25,82 | R54.2 v62.25,82 | R55.2 v57.25,82 | R56.2 v52.25,82 | R57.2 v47.25,82 | R58.2 v42.25,82 | R59.2 v37.25,82 | v96.5,79 96.5,60 94.5,58 v94.5,53.2 | R48.2 v92.25,82 | R46.2 v88.75,13 | R45.2 v83.75,13 | R43.2 v73.75,13 | R42.2 v68.75,13 | R40.2 v58.75,13 | R41.2 v63.75,13 | R39.2 v53.75,13 | R38.2 v48.75,13 | R36.2 v38.75,13 | R37.2 v43.75,13 | R47.2 v93.75,13 | R44.2 v78.75,13
  Top 0.406: U1.5V 69.52,24.88 66.8,27.6 55.8,27.6 51.7,31.7 51.7,40.5 | 51.7,40.5 51.7,46 U2.3 | 42.65,36.1 39.25,36.1 C4.1 | 42.65,36.1 47.3,36.1 51.7,40.5 | C7.+ 42.65,36.1 | JP2.1 38,61 48,51 U4.1 | JP14.3 v96.28,38.98
  Bottom 0.25: v13.5,12 v13.5,17 v13.5,22 v13.5,27 v13.5,32 v13.5,37 v13.5,42 v13.5,47 13.5,52.5 16,55 v19.25,55 v19.25,44.75 v19.25,42.5 v19.25,30.5 v19.25,18 | v34.5,55.75 34.5,60 JP2.1 | v37.25,82 v42.25,82 v47.25,82 v52.25,82 v57.25,82 v62.25,82 v67.25,82 v72.25,82 v77.25,82 v82.25,82 v87.25,82 v92.25,82 93.5,82 v96.5,79 | v38.75,13 v43.75,13 v48.75,13 v53.75,13 v58.75,13 v63.75,13 v68.75,13 v73.75,13 v78.75,13 v83.75,13 v88.75,13 91.5,13 | 91.5,13 v93.75,13 | U1.5V 69.52,22.73 70.5,21.75 84.5,21.75 91.5,14.75 91.5,13
  Bottom 0.406: U2.3 49.19,48.54 U4.1 49.2,52.4 50,53.2 68.1,53.2 69.3,54.4 70.1,54.4 73.1,57.4 81.3,57.4 | 81.3,57.4 81.3,56.4 84.5,53.2 v94.5,53.2 95.87,53.2 U1.5V@ISP 99.2,49.87 99.2,41.9 v96.28,38.98 | 81.3,57.4 v83.3,59.4
!RESET  (via drill 0.5)
  Top 0.254: C29.1 85.3,66.5 80.8,62 80.8,56.5 81.4,55.9 81.4,49.5 81.1,49.2 | v64.4,32.7 69.5,37.8 v69.5,39.3 | 81.1,49.2 R3.1 | 81.1,49.2 U3.29 | U1.!RESET@ISP v87.1,46.4 83.9,46.4 81.1,49.2
  Bottom 0.254: U1.!RESET 64.4,23.58 v64.4,32.7 | v69.5,39.3 71.3,41.1 81.4,41.1 86.7,46.4 v87.1,46.4
A0
  Top 0.25: U1.A0 83.51,22.25 85,22.25 87.45,19.8 LED27.A
  Top 0.254: U3.23 78.25,46.15 79.8,44.6 79.8,32.7 82.22,30.28 U1.A0
A1
  Top 0.25: 90.25,20.25 90.5,20 | 90.25,20.25 89.5,21 87.3,21 U1.A1 | LED28.A 90.25,19.8 90.25,20.25
  Top 0.254: U3.24 79.05,46.55 80.3,45.3 80.3,32.8 84.76,28.34 U1.A1
A2
  Top 0.25: U1.A2 87.3,22.2 88,21.5 92,21.5 92.5,21 LED25.A
  Top 0.254: U1.A2 87.3,26.5 80.8,33 80.8,45.4 79.4,46.8 U3.25
A3
  Top 0.25: U1.A3 89.84,22.66 90.5,22 94,22 94.5,21.5 LED26.A
  Top 0.254: U1.A3 89.84,25.86 88.1,27.6 86.9,27.6 81.3,33.2 81.3,45.5 80.1,46.7 80.1,47.6 80,47.7 U3.26
A4/SDA  (via drill 0.5)
  Top 0.25: v21.75,52.75 21.82,52.83 IC4.15 21.82,55.42 22.2,55.8 33.2,55.8 36.25,52.75 v40,52.75 | v21.75,15.5 21.75,17.02 IC2.15 | v21.75,27.5 21.75,29.02 IC1.15 | v21.75,40 21.75,41.52 IC3.15 | v54.25,57.75 54.8,57.75
  Top 0.254: 81.8,36.4 81.8,45.6 80.6,46.8 80.6,47.8 80.2,48.2 U3.27 | 81.8,36.4 81.8,33.4 87.1,28.1 90,28.1 92.38,25.72 U1.A4 | v82.1,36.4 81.8,36.4 | U1.SDA 54.8,69.76 54.8,57.75 54.8,56.4 71.6,39.6 76.9,39.6 v77.2,39.9
  Bottom 0.25: JP14.2 84.46,36.4 v82.1,36.4 | v21.75,15.5 v21.75,27.5 v21.75,40 v21.75,52.75 | v40,52.75 44.25,57 52,57 52.75,57.75 v54.25,57.75
  Bottom 0.254: v77.2,39.9 77.2,39.1 78.2,38.1 80.4,38.1 v82.1,36.4
A5/SCL  (via drill 0.5)
  Top 0.25: JP14.1 82.9,35.5 82.9,36.2 | v23,52.75 23.09,52.84 IC4.14 23.09,54.95 23.5,55.35 32.9,55.35 36.25,52 39.5,52 v40.5,51 | v23,15.5 23,17 IC2.14 | v23,27.5 23,29 IC1.14 | v23,40 23,41.51 IC3.14 | 53.5,57.1 v53.5,57
  Top 0.254: U1.A5 94.92,25.68 92,28.6 87.3,28.6 82.3,33.6 82.3,35.4 82.9,36 82.9,36.2 82.9,37.5 v82.7,37.7 82.3,38.1 82.3,45.7 81.1,46.9 81.1,48 80.4,48.7 U3.28 | U1.SCL 54.3,67.72 54.3,59.3 53.5,58.5 53.5,57.1 71.5,39.1 78.5,39.1 v78.8,39.4
  Bottom 0.25: v23,52.75 v23,40 v23,27.5 v23,15.5 | v40.5,51 46,56.5 52.5,56.5 53,57 v53.5,57
  Bottom 0.254: v78.8,39.4 81,39.4 v82.7,37.7
AREF
  Top 0.254: U1.AREF 55.3,56.5 68.6,43.2 76,43.2 76.75,43.95 C3.2 U3.20
D0/RX  (via drill 0.5)
  Top 0.254: U1.D0 93.62,70.5 91.8,70.5 89.5,68.2 86.3,68.2 80.3,62.2 80.3,56.3 80.9,55.7 80.9,50.7 79.9,49.7 U3.30 | R32.2 v87.9,61.5
  Bottom 0.254: v87.9,61.5 88.8,62.4 88.8,67.5 91.8,70.5 93.62,70.5 U1.D0
D1/TX  (via drill 0.5)
  Top 0.254: U1.D1 89.28,68.7 86.1,68.7 79.8,62.4 79.8,56.1 80.4,55.5 80.4,50.8 79.8,50.2 U3.31 | R31.2 v87.9,64
  Bottom 0.254: v87.9,64 87.9,67.32 U1.D1
D2/INPUT_INT  (1 unrouted)
  Top 0.254: U1.D2 87.24,69.2 85.9,69.2 79.3,62.6 79.3,50.8 U3.32
D3
  Top 0.254: U3.1 78.75,62.75 85.3,69.3 85.3,69.8 U1.D3
D4
  Top 0.254: U1.D4 84.8,71.76 84.8,69.5 78.25,62.95 U3.2
D5
  Top 0.254: U1.D5 82.2,71.78 82.2,69.3 71.1,58.2 71.1,52.3 72.7,50.7 U3.9
D6
  Top 0.254: U1.D6 79.68,67.48 70.6,58.4 70.6,52.1 72.5,50.2 U3.10
D7
  Top 0.254: U3.11 72.4,49.7 70.1,52 70.1,58.5 77.14,65.54 U1.D7
D8
  Top 0.254: U3.12 72.3,49.2 69.6,51.9 69.6,66.8 73.08,70.28 U1.D8
D9
  Top 0.254: U3.13 72.2,48.7 69.1,51.8 69.1,67 70.54,68.44 U1.D9
D10/ETHERNER_SS
  Top 0.254: U3.14 72.1,48.2 68.6,51.7 68.6,66.8 68,67.4 U1.D10
D11/MOSI  (via drill 0.5)
  Top 0.254: U3.15 v71.3,47.7 70.8,47.7 68.7,49.8 68.7,51 68.1,51.6 68.1,66.7 65.46,69.34 U1.D11
  Bottom 0.254: U1.MOSI 97.59,48.89 96.4,47.7 87.2,47.7 81.2,41.7 75.2,41.7 71.3,45.6 v71.3,47.7
D12/MISO  (via drill 0.5)
  Top 0.254: U3.16 72.8,47.2 v72.5,46.9 71,46.9 68.2,49.7 68.2,50.9 67.6,51.5 67.6,66.6 62.92,71.28 U1.D12
  Bottom 0.254: U1.MISO 95.05,51.35 92.4,48.7 87,48.7 81,42.7 75.5,42.7 72.9,45.3 72.9,46.5 v72.5,46.9
D13/SCK  (via drill 0.5)
  Top 0.254: U1.D13 60.38,71.02 61.8,69.6 64,69.6 67.1,66.5 67.1,51.4 67.7,50.8 67.7,49.6 71.2,46.1 72.1,46.1 | U3.17 73.4,46.55 72.95,46.1 72.1,46.1 | v72.1,45.9 72.1,46.1
  Bottom 0.254: U1.SCK 93.24,48.94 92.5,48.2 87.1,48.2 81.1,42.2 75.3,42.2 72.1,45.4 v72.1,45.9
DTR
  Top 0.254: JP6.6 90.8,66.5 C29.2
FTDI_PWR
  Top 0.25: JP6.3 91.3,59.38 C38.2 85.33,59.38
  Top 0.406: 85.33,59.38 SJ9.1
GND  (via drill 0.5)
  Top 0.254: U3.5 76.75,49.2 U3.PAD | U3.PAD 77.75,49.7 U3.3 | U3.21 77.25,48.95 U3.PAD
  other vias: 77,48.95 76.1,48.05 77.9,48.05 77.9,49.85 76.1,49.85 77.5,54.95 73.8,45.7 82.6,46.5 83.4,48.1 73.8,56.2 82.4,52.9 82.5,56.8 65.2,48.8 65.2,54.1 66.2,58.5 50.6,58.3 46.8,50.1 53,43.7 46.7,43 53.7,37.4 58.9,37.1 55.4,29.9 63.3,30.8 58.7,32.6 65.5,30.9 63.2,28.5 65.4,28.5 79.7,23.4 74.1,37.4 70.7,42.1 70.1,45.5 60,47.1 58.4,65.2 73.7,64.8 75.7,59.1 84.9,63.2 94.8,67 96.55,54.2 91.1,42.6 94.5,32.5 36.5,32.6 46.5,65.8 72.7,58.2 81.7,59.4 66.1,51.3 49,62 89,51 98,38 91,37 80,28 75,33 69,32 71,28 63,40 63,45 54,33 49,33 46.25,33 42.25,28.75 46.25,28.75 40,25 50,25 40,40 40,45 40,50 50,30 40,27.5 83,20 79.5,20 76,20 72.5,20.5 69,21 65.5,21.5 62,22 55.5,22.5 51.5,22.5 49,22.5 44.5,22.5 53.5,15.25 57,15.25 60.25,15.25 64.25,15.25 67.75,15.25 69.75,15.25 71.75,15.25 74.25,15.25 77.75,15.25 80.25,16 83.75,16.25 96,18.75 30.75,8 29.5,6.5 21.75,6.25 19.25,15 18,28.25 29.5,18.5 30.5,20 29.5,31 30.5,32.5 20.5,34.25 14,54.75 17,53.75 20.5,52.75 29,46.75 29,43.5 24,43.25 20.5,43.25 17.5,36.25 5,5 5,10 5,15 5,25 5,35 5,45 15,10 30,5 45,5 60,5 75,5 90,5 35,40 35,50 35,90 45,90 60,90 75,90 90,90 90,75 79.5,75 83,75 86.5,75 82.5,79.25 72,79.5 68.5,79.5 66.75,80.5 64.75,79.5 63,80.75 61.5,79.25 59.25,80 57.75,79 54.25,79 49.75,80 39.5,80.25 37,75 47.5,72.5 44,72.5 41,72.5 43.25,70.75 51.5,72.75 54,72.75 59.25,73.25 61.75,73.75 65,74.25 69,74.75 72.5,75 76,75 96.5,81.5 94.5,79 43.75,63.75 46,62 41,31.5 44.25,31 29.25,27 24.25,24.75 20.5,24.75 23.5,12 24.5,36.5 20.75,46.25 5,55
  pour Bottom: 0,1 arc90 1,0 96.46,0 arc90 97.46,1 97.46,23.54 100,26.1 100,58.85 97.46,61.39 97.46,93 arc90 95.46,95 31,95 arc90 29,93 29,59 arc-90 27,57 2,57 arc90 0,55
  pour Top: 97.46,61.39 97.46,93 arc90 95.46,95 31,95 arc90 29,93 29,59 arc-90 27,57 2,57 arc90 0,55 0,1 arc90 1,0 96.46,0 arc90 97.46,1 97.46,23.54 100,26.1 100,58.85
I0
  Top 0.25: JP15.3 R26.1 11.5,46.5 12.25,45.75 19,45.75 21.1,47.85 24.05,47.85 24.36,47.53 IC4.4
I1  (via drill 0.5)
  Top 0.25: JP15.2 R27.1 11.5,41 13,39.5 v17.5,39.5 | IC4.5 25.64,47.62 24.95,48.3 20.3,48.3 v18.5,46.5
  Bottom 0.25: v18.5,46.5 17.5,45.5 v17.5,39.5
I2  (via drill 0.5)
  Top 0.25: JP15.1 R28.1 11.5,37.5 12,38 v17,38 | IC4.6 26.91,47.84 26,48.75 19.25,48.75 v18,47.5
  Bottom 0.25: v18,47.5 16.75,46.25 16.75,38.25 v17,38
I3  (via drill 0.5)
  Top 0.25: JP16.3 R29.1 11.5,33.5 12.5,34.5 v16.5,34.5 | IC4.7 28.18,48.58 27.55,49.2 18.2,49.2 v17.25,48.25
  Bottom 0.25: v16.5,34.5 16.25,34.75 16.25,47.25 v17.25,48.25
I4  (via drill 0.5)
  Top 0.25: JP16.2 R30.1 11.5,28.75 12.25,29.5 v16,29.5 | IC4.9 29.45,52.2 27.9,50.65 18.15,50.65 v16.5,49
  Bottom 0.25: v16.5,49 15.75,48.25 15.75,29.75 v16,29.5
I5  (via drill 0.5)
  Top 0.25: JP16.1 R35.1 11.5,23.5 12.5,24.5 v15.5,24.5 | IC4.10 28.18,52.17 27.1,51.1 17.1,51.1 v15.75,49.75
  Bottom 0.25: v15.5,24.5 15.25,24.75 15.25,49.25 v15.75,49.75
I6  (via drill 0.5)
  Top 0.25: JP17.2 R33.1 11.5,18 12.5,19 v15,19 | IC4.11 26.91,52.16 26.3,51.55 16.05,51.55 v15,50.5
  Bottom 0.25: v15,19 14.75,19.25 14.75,50.25 v15,50.5
I7  (via drill 0.5)
  Top 0.25: JP17.1 R34.1 11.5,13 12,13.5 v14.5,13.5 | IC4.12 25.64,52.63 25,52 15,52 v14.25,51.25
  Bottom 0.25: v14.5,13.5 14.25,13.75 v14.25,51.25
N$1
  Top 0.25: LED1.A 36.75,11.55 R36.1
N$2
  Top 0.25: LED2.A 41.75,11.55 R37.1
N$3
  Top 0.254: Q1.1 75.75,53.06 U3.7
N$4
  Top 0.254: Q1.3 73,53.81 73,52.5 74.15,51.35 U3.8
N$5
  Top 0.25: R62.1 LED27.C
N$6
  Top 0.25: LED3.A 46.75,11.55 R38.1
N$7
  Top 0.25: LED4.A 51.75,11.55 R39.1
N$8
  Top 0.25: LED5.A 56.75,11.55 R40.1
N$9
  Top 0.25: LED6.A 61.75,11.55 R41.1
N$10
  Top 0.25: LED7.A 66.75,11.55 R42.1
N$11
  Top 0.25: LED8.A 71.75,11.55 R43.1
N$12
  Top 0.25: LED9.A 76.75,11.55 R44.1
N$13
  Top 0.25: LED10.A 81.75,11.55 R45.1
N$14
  Top 0.25: LED11.A 86.75,11.55 R46.1
N$15
  Top 0.25: LED12.A 91.75,11.55 R47.1
N$16
  Top 0.25: LED13.A 94.3,82.05 R48.1
N$17
  Top 0.25: LED14.A 89.3,82.05 R49.1
N$18
  Top 0.25: LED15.A 84.3,82.05 R50.1
N$19
  Top 0.25: LED16.A 79.3,82.05 R51.1
N$20
  Top 0.25: LED17.A 74.3,82.05 R52.1
N$21
  Top 0.25: LED18.A 69.3,82.05 R53.1
N$22
  Top 0.25: LED19.A 64.3,82.05 R54.1
N$23
  Top 0.25: LED20.A 59.3,82.05 R55.1
N$24
  Top 0.25: LED21.A 54.3,82.05 R56.1
N$25
  Top 0.25: LED22.A 49.3,82.05 R57.1
N$26
  Top 0.25: LED23.A 44.3,82.05 R58.1
N$27
  Top 0.25: LED24.A 39.3,82.05 R59.1
N$28
  Top 0.25: LED28.C R63.1
N$29
  Top 0.25: R60.1 LED25.C
N$30
  Top 0.25: R61.1 LED26.C
P0  (via drill 0.5)
  Top 0.25: R4.2 46.75,18.95 Q3.1 47.75,17.95 v47.75,17 47.75,16 47.25,15.5 45.25,15.5 44.25,14.5 40.75,14.5 39.75,13.5 39.75,11.95 LED1.C | IC2.4 24.36,8.87 27.75,12.25 v33.5,12.25
  Bottom 0.25: v47.75,17 38.75,17 34,12.25 v33.5,12.25
P1  (via drill 0.5)
  Top 0.25: R1.2 50.25,18.95 Q2.1 51.25,17.95 v51.25,17 51.25,16 50.75,15.5 50.25,15.5 49.25,14.5 45.75,14.5 44.75,13.5 44.75,11.95 LED2.C | IC2.5 25.64,8.88 28,11.25 v33,11.25
  Bottom 0.25: v51.25,17 49.25,17 48.25,16 47.25,16 46.75,16.5 39,16.5 33.75,11.25 v33,11.25
P2  (via drill 0.5)
  Top 0.25: R2.2 53.75,18.95 Q4.1 54.75,17.95 v54.75,17 54.75,15.25 54,14.5 50.75,14.5 49.75,13.5 49.75,11.95 LED3.C | IC2.6 26.91,8.9 28.25,10.25 v32.5,10.25
  Bottom 0.25: v54.75,17 52.75,17 51.75,16 49,16 48.5,15.5 47,15.5 46.5,16 39.25,16 33.5,10.25 v32.5,10.25
P3  (via drill 0.5)
  Top 0.25: R5.2 57.25,18.95 Q5.1 58.25,17.95 v58.25,17 58.25,15.25 57.5,14.5 55.75,14.5 54.75,13.5 54.75,11.95 LED4.C | IC2.7 28.18,8.68 29,9.5 v31.75,9.5
  Bottom 0.25: v58.25,17 56.25,17 55.25,16 52.5,16 52,15.5 49.25,15.5 48.75,15 46.75,15 46.25,15.5 39.5,15.5 33.5,9.5 v31.75,9.5
P4  (via drill 0.5)
  Top 0.25: R6.2 60.75,18.95 Q6.1 61.75,17.95 v61.75,17 61.75,15.5 59.75,13.5 59.75,11.95 LED5.C | IC2.9 29.45,13.7 v28.75,13
  Bottom 0.25: v61.75,17 59.75,17 58.75,18 47.25,18 46.75,17.5 38.5,17.5 34,13 v28.75,13
P5  (via drill 0.5)
  Top 0.25: R7.2 64.25,18.95 Q7.1 65.25,17.95 v65.25,17 65.25,14 64.75,13.5 64.75,11.95 LED6.C | v28,13.75 28,15.75 28.18,15.93 IC2.10
  Bottom 0.25: v65.25,17 63.25,17 62.25,18 59.75,18 59.25,18.5 47,18.5 46.5,18 38.25,18 34,13.75 v28,13.75
P6  (via drill 0.5)
  Top 0.25: R8.2 67.75,18.95 Q8.1 68.75,17.95 v68.75,17 68.75,14.5 69.75,13.5 69.75,11.95 LED7.C | v27.25,14.5 27.25,15.75 26.91,16.09 IC2.11
  Bottom 0.25: v68.75,17 66.75,17 65.75,18 63.25,18 62.75,18.5 60,18.5 59.5,19 46.75,19 46.25,18.5 38,18.5 34,14.5 v27.25,14.5
P7  (via drill 0.5)
  Top 0.25: R9.2 71.25,18.95 Q9.1 72.25,17.95 v72.25,17 72.25,16 74.75,13.5 74.75,11.95 LED8.C | IC2.12 25.64,16.11 v26.5,15.25
  Bottom 0.25: v72.25,17 70.25,17 69.25,18 66.5,18 66,18.5 63.5,18.5 63,19 60.25,19 59.75,19.5 46.5,19.5 46,19 37.75,19 34,15.25 v26.5,15.25
P8  (via drill 0.5)
  Top 0.25: R10.2 74.75,18.95 Q10.1 75.75,17.95 v75.75,17 75.75,15.75 77.5,14 79.25,14 79.75,13.5 79.75,11.95 LED9.C | IC1.4 24.36,22.86 26,24.5 31.5,24.5 v32,24
  Bottom 0.25: v75.75,17 73.75,17 72.75,18 70,18 69.5,18.5 66.75,18.5 66.25,19 63.75,19 63.25,19.5 60.5,19.5 60,20 34.75,20 32,22.75 v32,24
P9  (via drill 0.5)
  Top 0.25: R11.2 78.25,18.95 Q11.1 79.25,17.95 v79.25,17 79.25,15.75 81,14 84.25,14 84.75,13.5 84.75,11.95 LED10.C | IC1.5 25.64,23.14 26.5,24 30.5,24 31.25,23.25 32.75,23.25 v33,23.5
  Bottom 0.25: v79.25,17 77.25,17 76.25,18 73.5,18 73,18.5 70.25,18.5 69.75,19 67,19 66.5,19.5 64,19.5 63.5,20 60.75,20 60.25,20.5 35,20.5 33,22.5 v33,23.5
P10  (via drill 0.5)
  Top 0.25: R12.2 81.75,18.95 Q12.1 82.75,17.95 v82.75,17 82.75,16 83.75,15 84.75,15 85.75,14 89.25,14 89.75,13.5 89.75,11.95 LED11.C | IC1.6 26.91,22.91 27.5,23.5 30.25,23.5 31.25,22.5 33.5,22.5 v34,23
  Bottom 0.25: v82.75,17 80.75,17 79.75,18 77,18 76.5,18.5 73.75,18.5 73.25,19 70.5,19 70,19.5 67.25,19.5 66.75,20 64.25,20 63.75,20.5 61,20.5 60.5,21 36,21 v34,23
P11  (via drill 0.5)
  Top 0.25: R13.2 85.25,18.95 Q13.1 86.25,17.95 v86.25,17 86.25,15.75 87,15 90,15 91,14 94.25,14 94.75,13.5 94.75,11.95 LED12.C | IC1.7 28.18,22.68 28.5,23 30,23 31,22 34.5,22 v35.5,23
  Bottom 0.25: v86.25,17 84.25,17 83.25,18 80.5,18 80,18.5 77.25,18.5 76.75,19 74,19 73.5,19.5 70.75,19.5 70.25,20 67.5,20 67,20.5 64.5,20.5 64,21 61.25,21 60.75,21.5 37,21.5 v35.5,23
P12  (via drill 0.5)
  Top 0.25: R14.2 84.25,76.05 Q14.1 83.25,77.05 v83.25,78 83.25,78.75 84,79.5 89,79.5 91.5,82 91.5,83.3 LED13.C | IC1.9 29.45,28.05 30.25,27.25 34.75,27.25 v35,27
  Bottom 0.25: v83.25,78 81.25,78 80.25,77 77.5,77 77,76.5 74.25,76.5 73.75,76 71,76 70.5,75.5 67.75,75.5 67.25,75 64.5,75 64,74.5 61.25,74.5 60.75,74 58,74 57.5,73.5 42.5,73.5 42,74 39.75,74 38.75,73 38.75,31.25 35,27.5 v35,27
P13  (via drill 0.5)
  Top 0.25: R15.2 80.75,76.05 Q15.1 79.75,77.05 v79.75,78 79.75,79 81.25,80.5 85,80.5 86.5,82 86.5,83.3 LED14.C 87,83.5 | IC1.10 28.18,26.32 28.5,26 30.25,26 31,26.75 33.75,26.75 v34,26.5
  Bottom 0.25: v79.75,78 77.75,78 76.75,77 74,77 73.5,76.5 70.75,76.5 70.25,76 67.5,76 67,75.5 64.25,75.5 63.75,75 61,75 60.5,74.5 57.75,74.5 57.25,74 42.75,74 42.25,74.5 39.5,74.5 38.25,73.25 38.25,31.5 34,27.25 v34,26.5
P14  (via drill 0.5)
  Top 0.25: R16.2 77.25,76.05 Q16.1 76.25,77.05 v76.25,78 76.25,78.75 77.5,80 79.25,80 81.5,82.25 81.5,83.3 LED15.C | IC1.11 26.91,26.09 27.5,25.5 30.5,25.5 31.25,26.25 32.75,26.25 v33,26
  Bottom 0.25: v76.25,78 74.25,78 73.25,77 70.5,77 70,76.5 67.25,76.5 66.75,76 64,76 63.5,75.5 60.75,75.5 60.25,75 57.5,75 57,74.5 43,74.5 42.5,75 39.25,75 37.75,73.5 37.75,31.75 33,27 v33,26
P15  (via drill 0.5)
  Top 0.25: R17.2 73.75,76.05 Q17.1 72.75,77.05 v72.75,78 72.75,79.25 73.5,80 75,80 76.5,81.5 76.5,83.3 LED16.C | IC1.12 25.64,26.11 26.75,25 31.5,25 v32,25.5
  Bottom 0.25: v72.75,78 70.75,78 69.75,77 67,77 66.5,76.5 63.75,76.5 63.25,76 60.5,76 60,75.5 57.25,75.5 56.75,75 43.25,75 42.75,75.5 39,75.5 37.25,73.75 37.25,32 32,26.75 v32,25.5
P16  (via drill 0.5)
  Top 0.25: R18.2 70.25,76.05 Q18.1 69.25,77.05 v69.25,78 69.25,79.25 71.5,81.5 71.5,83.3 LED17.C | IC3.4 24.36,33.37 27.25,36.25 33.5,36.25 v33.75,36.5
  Bottom 0.25: v69.25,78 67.25,78 66.25,77 63.5,77 63,76.5 60.25,76.5 59.75,76 57,76 56.5,75.5 43.5,75.5 43,76 34.25,76 33.25,75 33.25,37 v33.75,36.5
P17  (via drill 0.5)
  Top 0.25: R19.2 66.75,76.05 Q19.1 65.75,77.05 v65.75,78 65.75,80.75 66.5,81.5 66.5,83.3 LED18.C | IC3.5 25.64,33.38 27.75,35.5 v33,35.5
  Bottom 0.25: v65.75,78 63.75,78 62.75,77 60,77 59.5,76.5 56.75,76.5 56.25,76 43.75,76 43.25,76.5 33.75,76.5 32.75,75.5 32.75,35.75 v33,35.5
P18  (via drill 0.5)
  Top 0.25: R20.2 63.25,76.05 Q20.1 62.25,77.05 v62.25,78 62.25,80.25 61,81.5 61,82.8 LED19.C | IC3.6 26.91,33.41 28.25,34.75 v32,34.75
  Bottom 0.25: v62.25,78 60.25,78 59.25,77 56.5,77 56,76.5 44,76.5 43.5,77 33.25,77 32.25,76 32.25,35 v32,34.75
P19  (via drill 0.5)
  Top 0.25: R21.2 59.75,76.05 Q21.1 58.75,77.05 v58.75,78 58.75,79.25 56.25,81.75 56.25,82.5 56.7,82.95 LED20.C | IC3.7 28.18,33.17 29,34 v30,34
  Bottom 0.25: v58.75,78 56.75,78 55.75,77 44.25,77 43.75,77.5 32.75,77.5 31.75,76.5 31.75,35.75 v30,34
P20  (via drill 0.5)
  Top 0.25: R22.2 56.25,76.05 Q22.1 55.25,77.05 v55.25,78 55.25,80 54.25,81 51.75,81 51.25,81.5 51.25,83.05 LED21.C | IC3.9 29.45,40.7 v29,40.25
  Bottom 0.25: v55.25,78 53.25,78 52.25,79 49.5,79 49,79.5 46.25,79.5 45.75,80 43.75,80 43.25,79.5 30.75,79.5 29.75,78.5 29.75,41 v29,40.25
P21  (via drill 0.5)
  Top 0.25: R23.2 52.75,76.05 Q23.1 51.75,77.05 v51.75,78 51.75,79.25 50,81 46.75,81 46.25,81.5 46.25,83.05 LED22.C | v29,39 28.18,39.83 IC3.10
  Bottom 0.25: v51.75,78 49.75,78 48.75,79 46,79 45.5,79.5 44,79.5 43.5,79 31.25,79 30.25,78 30.25,40.25 v29,39
P22  (via drill 0.5)
  Top 0.25: R24.2 49.25,76.05 Q24.1 48.25,77.05 v48.25,78 48.25,79.25 47.5,80 46,80 45,81 41.75,81 41.25,81.5 41.25,83.05 LED23.C | v29.5,38 28,38 26.91,39.09 IC3.11
  Bottom 0.25: v48.25,78 46.25,78 45.25,79 44.25,79 43.75,78.5 31.75,78.5 30.75,77.5 30.75,39.25 v29.5,38
P23  (via drill 0.5)
  Top 0.25: R25.2 45.75,76.05 Q25.1 44.75,77.05 v44.75,78 44.75,79.25 44,80 41,80 40,81 36.75,81 36.25,81.5 36.25,83.05 LED24.C | v30,37 27.5,37 25.64,38.87 IC3.12
  Bottom 0.25: v44.75,78 32.25,78 31.25,77 31.25,38.25 v30,37
R0
  Top 0.25: Q3.3 45.85,16 45,16 44,15 40.5,15 39.5,14 36.25,14 35.5,13.25 35.5,9.5 JP1.3
R1
  Top 0.25: Q2.3 48.35,15 45.5,15 44.5,14 41.25,14 40.5,13.25 40.5,9.5 JP1.2
R2
  Top 0.25: Q4.3 51.85,15 50.5,15 49.5,14 46.25,14 45.5,13.25 45.5,9.25 47.75,7 JP1.1
R3
  Top 0.25: Q5.3 54.35,14 51.5,14 50.5,13 50.5,9.5 JP3.3
R4
  Top 0.25: Q6.3 57.85,14 56.5,14 55.5,13 55.5,9.5 JP3.2
R5
  Top 0.25: Q7.3 60.5,13.15 60.5,9.5 JP3.1
R6
  Top 0.25: Q8.3 65.75,14.9 65.75,13.5 65.5,13.25 65.5,9.25 67.75,7 JP5.3
R7
  Top 0.25: Q9.3 70.5,16.15 70.5,9.5 JP5.2
R8
  Top 0.25: Q10.3 75.5,15.15 75.5,9.25 77.75,7 JP5.1
R9
  Top 0.25: Q11.3 80.5,13.65 80.5,9.25 82.75,7 JP8.3
R10
  Top 0.25: Q12.3 81.25,15.5 82.25,14.5 84.5,14.5 85.5,13.5 85.5,9.5 JP8.2
R11
  Top 0.25: Q13.3 84.75,15.75 86,14.5 89.5,14.5 90.5,13.5 90.5,9.5 JP8.1
R12
  Top 0.25: Q14.3 92.1,78.6 95.5,82 95.5,85.5 JP10.3
R13
  Top 0.25: Q15.3 81.25,79.25 82,80 88.5,80 90.5,82 90.5,85.5 JP10.2
R14
  Top 0.25: Q16.3 77.75,78.75 78.5,79.5 79.5,79.5 81,81 84.5,81 85.5,82 85.5,85.5 JP10.1
R15
  Top 0.25: Q17.3 74.6,78.6 76.5,80.5 79,80.5 80.5,82 80.5,85.5 JP11.3
R16
  Top 0.25: Q18.3 70.75,79.75 71.5,80.5 74.5,80.5 75.5,81.5 75.5,85.5 JP11.2
R17
  Top 0.25: Q19.3 67.25,79.75 68,80.5 69.5,80.5 70.5,81.5 70.5,85.5 JP11.1
R18
  Top 0.25: Q20.3 63.75,80.25 65.5,82 65.5,85.5 JP12.3
R19
  Top 0.25: Q21.3 60.25,80.25 60.5,80.5 60.5,85.5 JP12.2
R20
  Top 0.25: Q22.3 56.75,79.25 55.5,80.5 55.5,85.5 JP12.1
R21
  Top 0.25: Q23.3 50.5,81.35 50.5,85.5 JP13.3
R22
  Top 0.25: Q24.3 47.85,80.5 46.5,80.5 45.5,81.5 45.5,85.5 JP13.2
R23
  Top 0.25: Q25.3 44.35,80.5 41.5,80.5 40.5,81.5 40.5,85.5 JP13.1
RX_FTDI
  Top 0.254: JP6.4 90.88,61.5 R32.1
TX_FTDI
  Top 0.254: JP6.5 90.84,64 R31.1
VCC  (via drill 0.5)  (1 unrouted)
  Top 0.254: U3.18 C6.2 v75.75,44.05 | C1.2 76.47,53.9 76.5,53.9 | 76.75,52.6 77.25,52.1 U3.4 | 76.75,52.6 76.25,52.1 U3.6 | 76.75,52.6 76.75,53.52 76.4,53.87 | 76.4,53.87 76.43,53.9 | 76.4,53.87 v76.4,55 | R3.2 v84.2,49.2
  Top 0.406: v75.75,44.05 75.4,43.7 73.97,43.7 L1.2
  Bottom 0.254: v84.2,49.2 81.4,49.2
  Bottom 0.406: v76.4,55 77.5,56.1 79.8,56.1 81.4,54.5 81.4,49.2 81.4,46.8 78.65,44.05 v75.75,44.05
VIN
  Top 0.254: C2.1 41,68.35 41.1,68.45
  Top 0.406: C8.+ 41.1,68.45 38.05,68.45 JP2.3
  Top 0.813: U1.VIN 77.14,28.1 75.64,29.6 59.5,29.6 57.2,31.9 57.2,45.61 U2.1 54.31,48.5 46,48.5 37.8,56.7 35.7,56.7 32.1,60.3 32.1,67.6 JP2.3

### Text on the board
tPlace: R23 | R22 | R21 | R20 | R19 | R18 | R17 | R16 | R15 | R14 | R13 | R12 | R23 | R22 | R21 | R20 | R19 | R18 | R17 | R16 | R15 | R14 | R13 | R12 | VIN | VIN | DTR | GND | TX | GND | RX | 5V0 | FTDI | 5V0 | 5V0 | CTS | GND | 3V3 | 1 | 3V3 PowerPOD | I0 | 5V0 | ISP | I1 | GND | 5V0 | I2 | SDA | SCL | I3 | 5V0 PowerPOD | LCD Interface | I4 | v0.1 | I5 | I6 | R0 | R1 | R2 | R3 | R4 | R5 | R6 | R7 | R8 | R9 | R10 | R11 | I7 | R0 | R1 | R2 | R3 | R4 | R5 | R6 | R7 | R8 | R9 | R10 | R11 | HSNOTTS / Lighting